# Altium project Controller-RK3562.PrjPcb (part 3 of 8)

## Sheet RK3562-VCCIO2-VCCIO3.SchDoc
size 420 x 297 mm; SheetNumber: 8; SheetTotal: 32
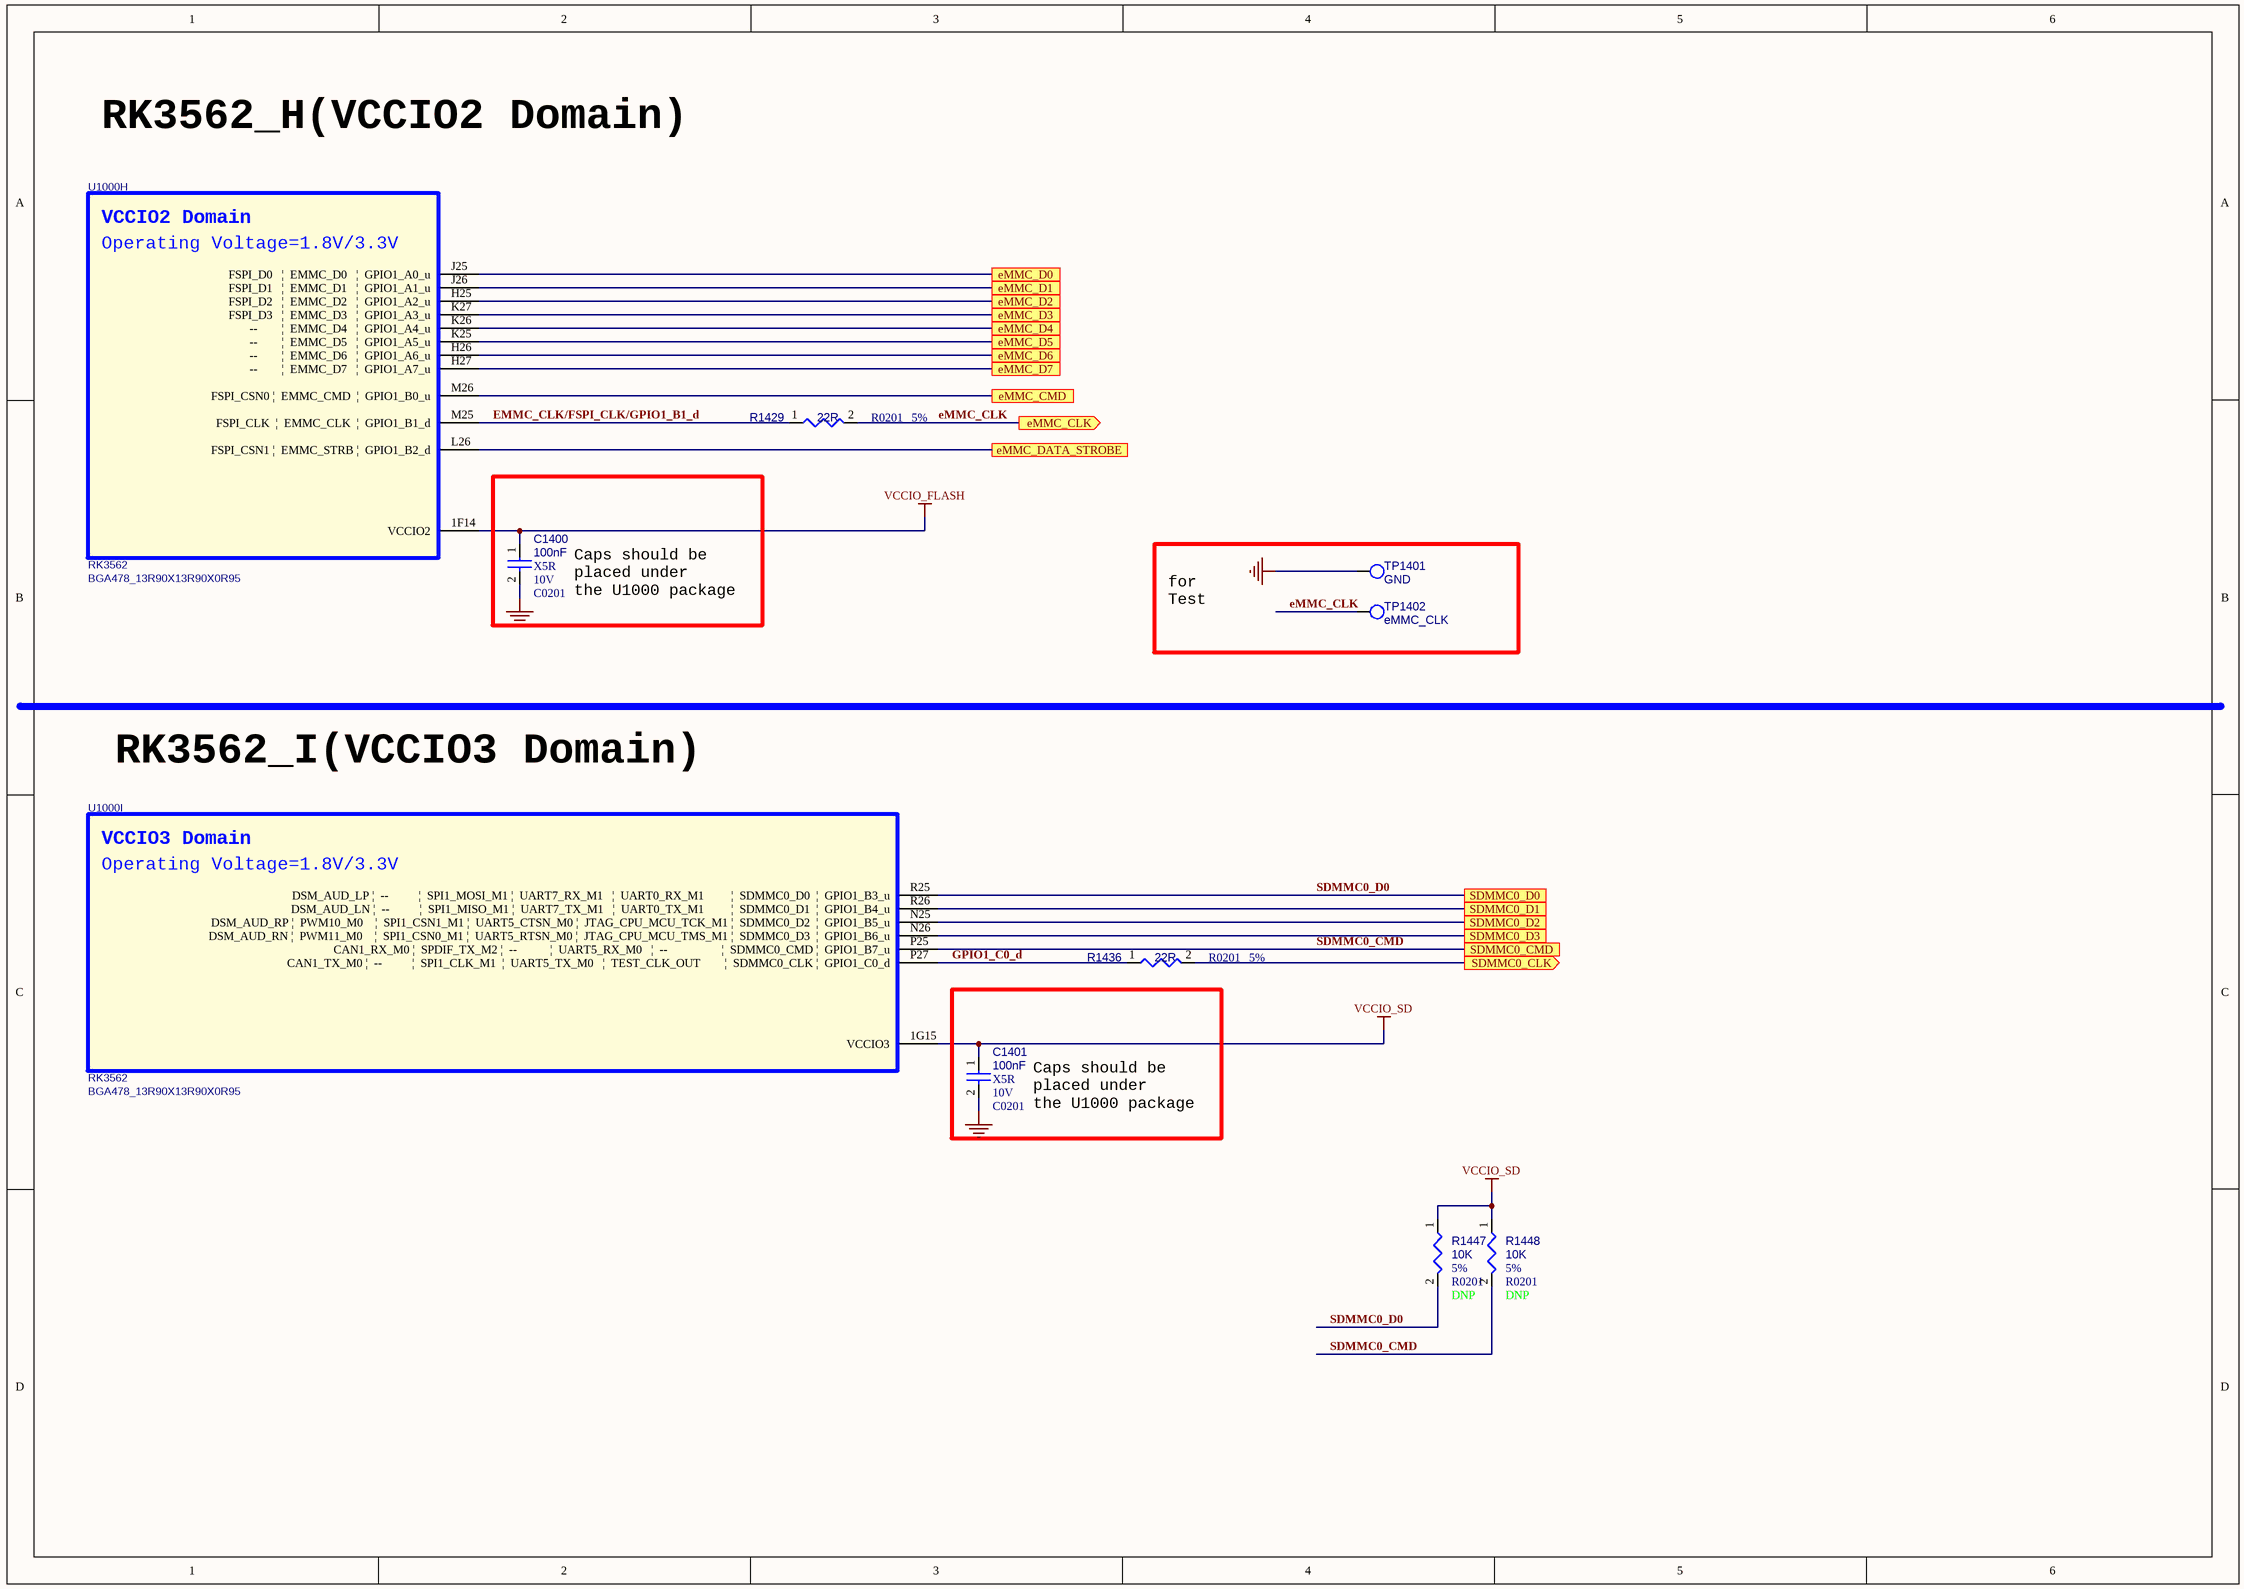
[diagram p9: RK3562-VCCIO2-VCCIO3.SchDoc]

### Parts
C1400  100nF  Dielectric: X5R  Voltage: 10V  [C0201]
C1401  100nF  Dielectric: X5R  Voltage: 10V  [C0201]
R1429  22R  Tolerance: 5%  [R0201]
R1436  22R  Tolerance: 5%  [R0201]
R1447  10K  Tolerance: 5%  option: DNP  [R0201]
R1448  10K  Tolerance: 5%  option: DNP  [R0201]
TP1401  GND  [TP_0R70]
TP1402  eMMC_CLK  [TP_0R70]
U1000  RK3562  [BGA478_13R90X13R90X0R95]  (parts H,I of 16)

### Ports
eMMC_CLK (out, see CONTROLLER-RK3562[4A], eMMC[2A]), eMMC_CMD (see CONTROLLER-RK3562[4A], eMMC[2A]), eMMC_D0 (see CONTROLLER-RK3562[4A], eMMC[2A]), eMMC_D1 (see CONTROLLER-RK3562[4A], eMMC[2A]), eMMC_D2 (see CONTROLLER-RK3562[4A], eMMC[2A]), eMMC_D3 (see CONTROLLER-RK3562[4A], eMMC[2A]), eMMC_D4 (see CONTROLLER-RK3562[4A], eMMC[2A]), eMMC_D5 (see CONTROLLER-RK3562[4A], eMMC[2A]), eMMC_D6 (see CONTROLLER-RK3562[4A], eMMC[2A]), eMMC_D7 (see CONTROLLER-RK3562[4A], eMMC[2A]), eMMC_DATA_STROBE (see CONTROLLER-RK3562[4A], eMMC[1B]), SDMMC0_CLK (out, see CONTROLLER-RK3562[4B], SD_TF-CARD[1A]), SDMMC0_CMD (see CONTROLLER-RK3562[4B], SD_TF-CARD[1A]), SDMMC0_D0 (see CONTROLLER-RK3562[4B], SD_TF-CARD[1A]), SDMMC0_D1 (see CONTROLLER-RK3562[4B], SD_TF-CARD[1A]), SDMMC0_D2 (see CONTROLLER-RK3562[4B], SD_TF-CARD[1A]), SDMMC0_D3 (see CONTROLLER-RK3562[4B], SD_TF-CARD[1A])

### Nets
GND: C1400.2 C1401.2 TP1401.1
VCCIO_FLASH: C1400.1 U1000.1F14(VCCIO2)
VCCIO_SD: C1401.1 R1447.1 R1448.1 U1000.1G15(VCCIO3)
eMMC_CLK: R1429.2 TP1402.1 ; port eMMC_CLK
EMMC_CLK/FSPI_CLK/GPIO1_B1_d: R1429.1 U1000.M25(FSPI_CLK__|__EMMC_CLK__|__GPIO1_B1_d)
eMMC_CMD: U1000.M26(FSPI_CSN0_|__EMMC_CMD__|__GPIO1_B0_u) ; port eMMC_CMD
eMMC_D0: U1000.J25(FSPI_D0___|__EMMC_D0___|__GPIO1_A0_u) ; port eMMC_D0
eMMC_D1: U1000.J26(FSPI_D1___|__EMMC_D1___|__GPIO1_A1_u) ; port eMMC_D1
eMMC_D2: U1000.H25(FSPI_D2___|__EMMC_D2___|__GPIO1_A2_u) ; port eMMC_D2
eMMC_D3: U1000.K27(FSPI_D3___|__EMMC_D3___|__GPIO1_A3_u) ; port eMMC_D3
eMMC_D4: U1000.K26(--________|__EMMC_D4___|__GPIO1_A4_u) ; port eMMC_D4
eMMC_D5: U1000.K25(--________|__EMMC_D5___|__GPIO1_A5_u) ; port eMMC_D5
eMMC_D6: U1000.H26(--________|__EMMC_D6___|__GPIO1_A6_u) ; port eMMC_D6
eMMC_D7: U1000.H27(--________|__EMMC_D7___|__GPIO1_A7_u) ; port eMMC_D7
eMMC_DATA_STROBE: U1000.L26(FSPI_CSN1_|__EMMC_STRB_|__GPIO1_B2_d) ; port eMMC_DATA_STROBE
GPIO1_C0_d: R1436.1 U1000.P27(CAN1_TX_M0_|__--__________|__SPI1_CLK_M1__|__UART5_TX_M0___|__TEST_CLK_OUT________|__SDMMC0_CLK_|__GPIO1_C0_d)
SDMMC0_CLK: R1436.2 ; port SDMMC0_CLK
SDMMC0_CMD: R1448.2 U1000.P25(CAN1_RX_M0_|__SPDIF_TX_M2_|__--___________|__UART5_RX_M0___|__--__________________|__SDMMC0_CMD_|__GPIO1_B7_u) ; port SDMMC0_CMD
SDMMC0_D0: R1447.2 U1000.R25(DSM_AUD_LP_|__--__________|__SPI1_MOSI_M1_|__UART7_RX_M1___|__UART0_RX_M1_________|__SDMMC0_D0__|__GPIO1_B3_u) ; port SDMMC0_D0
SDMMC0_D1: U1000.R26(DSM_AUD_LN_|__--__________|__SPI1_MISO_M1_|__UART7_TX_M1___|__UART0_TX_M1_________|__SDMMC0_D1__|__GPIO1_B4_u) ; port SDMMC0_D1
SDMMC0_D2: U1000.N25(DSM_AUD_RP_|__PWM10_M0____|__SPI1_CSN1_M1_|__UART5_CTSN_M0_|__JTAG_CPU_MCU_TCK_M1_|__SDMMC0_D2__|__GPIO1_B5_u) ; port SDMMC0_D2
SDMMC0_D3: U1000.N26(DSM_AUD_RN_|__PWM11_M0____|__SPI1_CSN0_M1_|__UART5_RTSN_M0_|__JTAG_CPU_MCU_TMS_M1_|__SDMMC0_D3__|__GPIO1_B6_u) ; port SDMMC0_D3

### Notes on the sheet
- RK3562_H(VCCIO2 Domain)
- Caps should be
  placed under
  the U1000 package
- for
  Test
- RK3562_I(VCCIO3 Domain)
- (in symbol SOC_RK3562, part H) VCCIO2 Domain; Operating Voltage=1.8V/3.3V
- (in symbol SOC_RK3562, part I) VCCIO3 Domain; Operating Voltage=1.8V/3.3V

### Library data of the parts
C1400 = CAP NP: cap,100.00nF,+/-10%,10V,X5R,C0201; Part Reference: C1400; Manufacturer PN: C0603X5R1A104K030BC; Manufacturer: TDK; Tolerance: 10%; Priority: A; PCB Footprint: C0201; Value: 100nF; Created by: JJJ; Part Type: C0201; RK PN: C0603X5R1A104K030BC; ClassName: RK
C1401 = CAP NP: cap,100.00nF,+/-10%,10V,X5R,C0201; Part Reference: C1401; Manufacturer: TDK; RK PN: C0603X5R1A104K030BC; Priority: A; Tolerance: 10%; PCB Footprint: C0201; Value: 100nF; Part Type: C0201; Manufacturer PN: C0603X5R1A104K030BC; Created by: JJJ; ClassName: RK
R1429 = RESISTOR: 通用厚膜电阻,22R,+/-5%,R0201,1/20W.; Part Reference: R1429; Manufacturer PN: RC0201JR-0722RL; Manufacturer: YAGEO; Wattage: 1/20W; Priority: A; RK PN: 901000523; PCB Footprint: R0201; Value: 22R; Created by: YTL; Part Type: 通用厚膜电阻; ClassName: RK
R1436 = RESISTOR: 通用厚膜电阻,22R,+/-5%,R0201,1/20W.; Part Reference: R1436; Manufacturer PN: RC0201JR-0722RL; Manufacturer: YAGEO; Wattage: 1/20W; Priority: A; RK PN: 901000523; PCB Footprint: R0201; Value: 22R; Created by: YTL; Part Type: 通用厚膜电阻; ClassName: RK
R1447 = RESISTOR: 通用厚膜电阻,10K,+/-5%,R0201,1/20W.; Part Reference: R1447; Manufacturer PN: RC0201JR-0710KL; Manufacturer: YAGEO; Wattage: 1/20W; Priority: A; RK PN: 901000476; PCB Footprint: R0201; Value: 10K; Created by: YTL; Part Type: 通用厚膜电阻; ClassName: RK
R1448 = RESISTOR: 通用厚膜电阻,10K,+/-5%,R0201,1/20W.; Part Reference: R1448; Manufacturer PN: RC0201JR-0710KL; Manufacturer: YAGEO; Wattage: 1/20W; Priority: A; RK PN: 901000476; PCB Footprint: R0201; Value: 10K; Created by: YTL; Part Type: 通用厚膜电阻; ClassName: RK
TP1401 = TP: Test Point 0.7mm; Part Reference: TP1401; RK PN: TESTPOINT_0R7; Priority: A; PCB Footprint: TP_0R70; Value: GND; Part Type: TP; Created by: JJJ; ClassName: RK
TP1402 = TP: Test Point 0.7mm; Part Reference: TP1402; Priority: A; RK PN: TESTPOINT_0R7; PCB Footprint: TP_0R70; Value: eMMC_CLK; Created by: JJJ; Part Type: TP; ClassName: RK
U1000 = SOC_RK3562: as U1000 on sheet RK3562-POWER-GND; PCB Footprint: BGA478_13R90X13R90X0R95; Value: RK3562; Created by: JJJ; Manufacturer PN: RK3562; Part Type: SOC; ClassName: RK

## Sheet RK3562-VCCIO4.SchDoc
size 420 x 297 mm; SheetNumber: 9; SheetTotal: 32
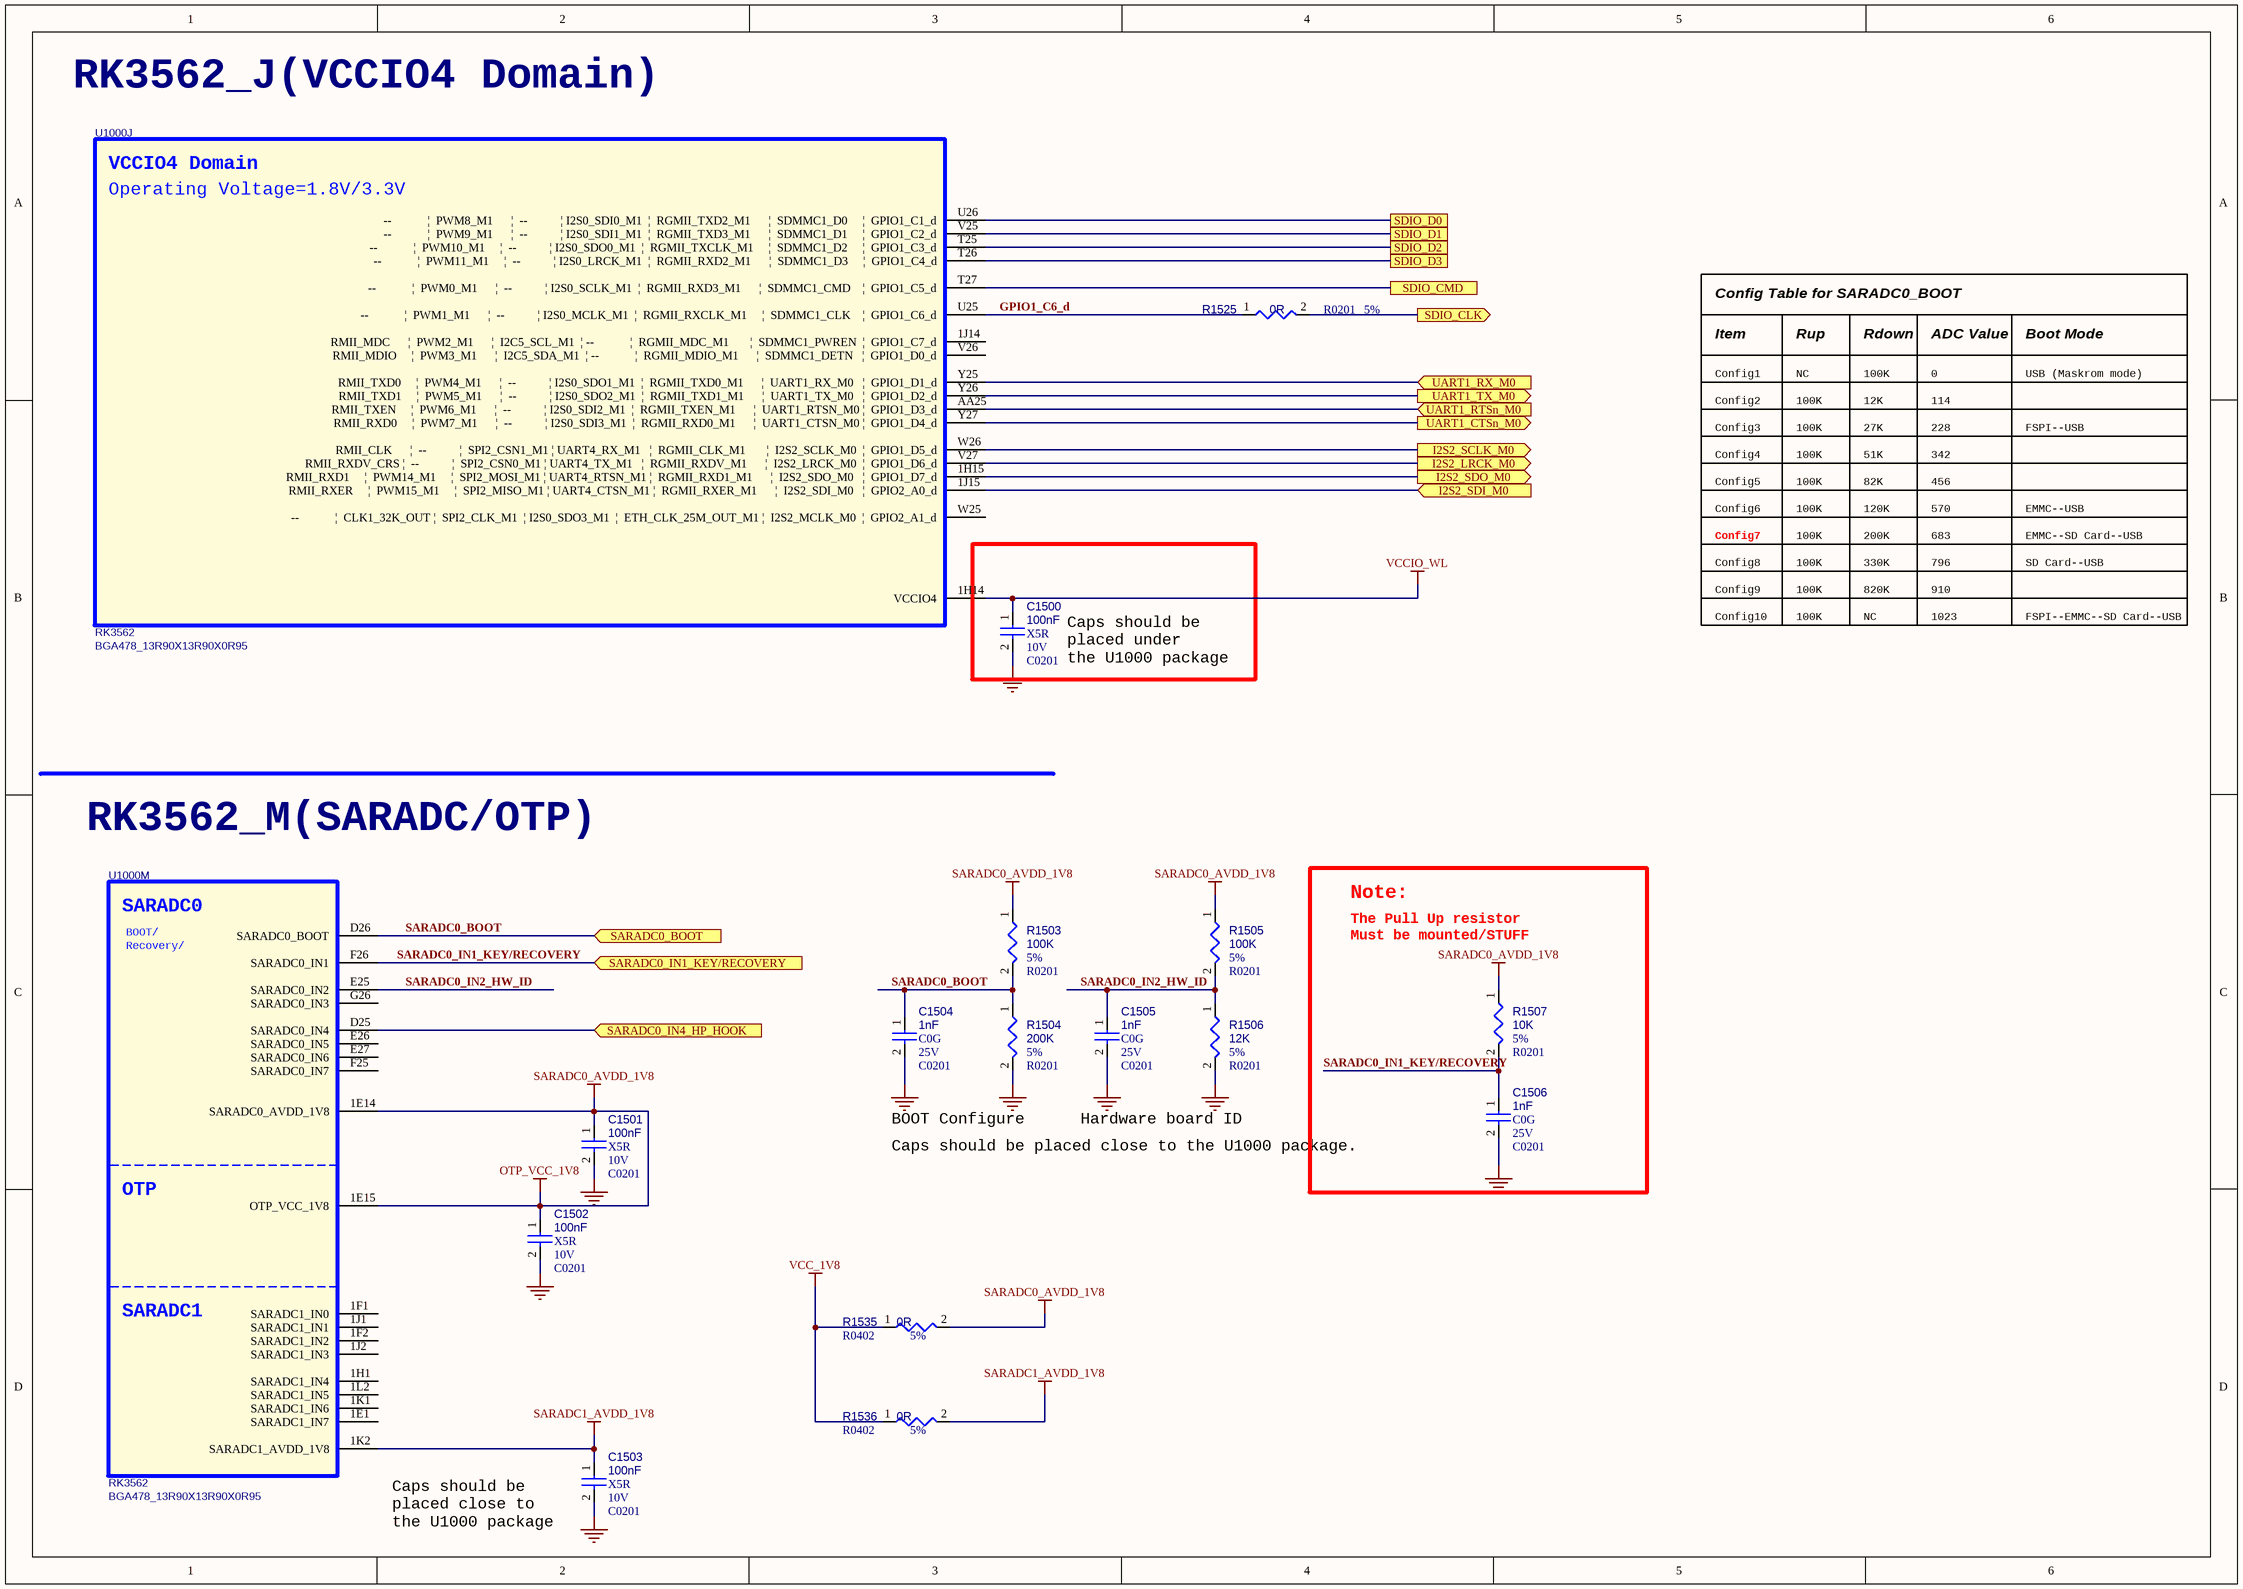
[diagram p10: RK3562-VCCIO4.SchDoc]

### Parts
C1500  100nF  Dielectric: X5R  Voltage: 10V  [C0201]
C1501  100nF  Dielectric: X5R  Voltage: 10V  [C0201]
C1502  100nF  Dielectric: X5R  Voltage: 10V  [C0201]
C1503  100nF  Dielectric: X5R  Voltage: 10V  [C0201]
C1504  1nF  Dielectric: C0G  Voltage: 25V  [C0201]
C1505  1nF  Dielectric: C0G  Voltage: 25V  [C0201]
C1506  1nF  Dielectric: C0G  Voltage: 25V  [C0201]
R1503  100K  Tolerance: 5%  [R0201]
R1504  200K  Tolerance: 5%  [R0201]
R1505  100K  Tolerance: 5%  [R0201]
R1506  12K  Tolerance: 5%  [R0201]
R1507  10K  Tolerance: 5%  [R0201]
R1525  0R  Tolerance: 5%  [R0201]
R1535  0R  Tolerance: 5%  [R0402]
R1536  0R  Tolerance: 5%  [R0402]
U1000  RK3562  [BGA478_13R90X13R90X0R95]  (parts J,M of 16)

### Blocks framed on the sheet
Note:: C1506 R1507

### Ports
I2S2_LRCK_M0 (out, see CONTROLLER-RK3562[4B], CONTROLLER-RK3562[3B], WF-BT-AP6256[1A]), I2S2_SCLK_M0 (out, see CONTROLLER-RK3562[4B], CONTROLLER-RK3562[3B], WF-BT-AP6256[1A]), I2S2_SDI_M0 (in, see CONTROLLER-RK3562[4B], CONTROLLER-RK3562[3B], WF-BT-AP6256[1B]), I2S2_SDO_M0 (out, see CONTROLLER-RK3562[4B], CONTROLLER-RK3562[3B], WF-BT-AP6256[1B]), SARADC0_BOOT (in, see CONTROLLER-RK3562[4B]), SARADC0_IN1_KEY/RECOVERY (in, see CONTROLLER-RK3562[4B]), SARADC0_IN4_HP_HOOK (in, see CONTROLLER-RK3562[4B]), SDIO_CLK (out, see CONTROLLER-RK3562[4B], CONTROLLER-RK3562[3B], WF-BT-AP6256[1A]), SDIO_CMD (see CONTROLLER-RK3562[4B], CONTROLLER-RK3562[3B], WF-BT-AP6256[1A]), SDIO_D0 (see CONTROLLER-RK3562[4B], CONTROLLER-RK3562[3B], WF-BT-AP6256[1A]), SDIO_D1 (see CONTROLLER-RK3562[4B], CONTROLLER-RK3562[3B], WF-BT-AP6256[1A]), SDIO_D2 (see CONTROLLER-RK3562[4B], CONTROLLER-RK3562[3B], WF-BT-AP6256[1A]), SDIO_D3 (see CONTROLLER-RK3562[4B], CONTROLLER-RK3562[3B], WF-BT-AP6256[1A]), UART1_CTSn_M0 (out, see CONTROLLER-RK3562[4B], CONTROLLER-RK3562[3B], WF-BT-AP6256[1A]), UART1_RTSn_M0 (in, see CONTROLLER-RK3562[4B], CONTROLLER-RK3562[3B], WF-BT-AP6256[1A]), UART1_RX_M0 (in, see CONTROLLER-RK3562[4B]), UART1_TX_M0 (out, see CONTROLLER-RK3562[4B])

### Nets
GND: C1500.2 C1501.2 C1502.2 C1503.2 C1504.2 C1505.2 C1506.2 R1504.2 R1506.2
OTP_VCC_1V8: C1501.1 C1502.1 R1503.1 R1505.1 R1507.1 R1535.2 U1000.1E14(SARADC0_AVDD_1V8) U1000.1E15(OTP_VCC_1V8)  [also labelled SARADC0_AVDD_1V8]
SARADC1_AVDD_1V8: C1503.1 R1536.2 U1000.1K2(SARADC1_AVDD_1V8)
VCC_1V8: R1535.1 R1536.1
VCCIO_WL: C1500.1 U1000.1H14(VCCIO4)
GPIO1_C6_d: R1525.1 U1000.U25(--____________|__PWM1_M1______|__--___________|_I2S0_MCLK_M1__|__RGMII_RXCLK_M1_____|__SDMMC1_CLK____|__GPIO1_C6_d)
I2S2_LRCK_M0: U1000.V27(RMII_RXDV_CRS_|__--___________|__SPI2_CSN0_M1_|_UART4_TX_M1___|__RGMII_RXDV_M1______|__I2S2_LRCK_M0__|__GPIO1_D6_d) ; port I2S2_LRCK_M0
I2S2_SCLK_M0: U1000.W26(RMII_CLK______|__--___________|__SPI2_CSN1_M1_|_UART4_RX_M1___|__RGMII_CLK_M1_______|__I2S2_SCLK_M0__|__GPIO1_D5_d) ; port I2S2_SCLK_M0
I2S2_SDI_M0: U1000.1J15(RMII_RXER_____|__PWM15_M1_____|__SPI2_MISO_M1_|_UART4_CTSN_M1_|__RGMII_RXER_M1______|__I2S2_SDI_M0___|__GPIO2_A0_d) ; port I2S2_SDI_M0
I2S2_SDO_M0: U1000.1H15(RMII_RXD1_____|__PWM14_M1_____|__SPI2_MOSI_M1_|_UART4_RTSN_M1_|__RGMII_RXD1_M1______|__I2S2_SDO_M0___|__GPIO1_D7_d) ; port I2S2_SDO_M0
SARADC0_BOOT: C1504.1 R1503.2 R1504.1 U1000.D26(SARADC0_BOOT) ; port SARADC0_BOOT
SARADC0_IN1_KEY/RECOVERY: C1506.1 R1507.2 U1000.F26(SARADC0_IN1) ; port SARADC0_IN1_KEY/RECOVERY
SARADC0_IN2_HW_ID: C1505.1 R1505.2 R1506.1 U1000.E25(SARADC0_IN2)
SDIO_CLK: R1525.2 ; port SDIO_CLK
SDIO_CMD: U1000.T27(--____________|__PWM0_M1______|__--___________|_I2S0_SCLK_M1__|__RGMII_RXD3_M1______|__SDMMC1_CMD____|__GPIO1_C5_d) ; port SDIO_CMD
SDIO_D0: U1000.U26(--____________|__PWM8_M1______|__--___________|_I2S0_SDI0_M1__|__RGMII_TXD2_M1______|__SDMMC1_D0_____|__GPIO1_C1_d) ; port SDIO_D0
SDIO_D1: U1000.V25(--____________|__PWM9_M1______|__--___________|_I2S0_SDI1_M1__|__RGMII_TXD3_M1______|__SDMMC1_D1_____|__GPIO1_C2_d) ; port SDIO_D1
SDIO_D2: U1000.T25(--____________|__PWM10_M1_____|__--___________|_I2S0_SDO0_M1__|__RGMII_TXCLK_M1_____|__SDMMC1_D2_____|__GPIO1_C3_d) ; port SDIO_D2
SDIO_D3: U1000.T26(--____________|__PWM11_M1_____|__--___________|_I2S0_LRCK_M1__|__RGMII_RXD2_M1______|__SDMMC1_D3_____|__GPIO1_C4_d) ; port SDIO_D3
UART1_CTSn_M0: U1000.Y27(RMII_RXD0_____|__PWM7_M1______|__--___________|_I2S0_SDI3_M1__|__RGMII_RXD0_M1______|__UART1_CTSN_M0_|__GPIO1_D4_d) ; port UART1_CTSn_M0
UART1_RTSn_M0: U1000.AA25(RMII_TXEN_____|__PWM6_M1______|__--___________|_I2S0_SDI2_M1__|__RGMII_TXEN_M1______|__UART1_RTSN_M0_|__GPIO1_D3_d) ; port UART1_RTSn_M0
UART1_RX_M0: U1000.Y26(RMII_TXD1_____|__PWM5_M1______|__--___________|_I2S0_SDO2_M1__|__RGMII_TXD1_M1______|__UART1_TX_M0___|__GPIO1_D2_d) ; port UART1_TX_M0
UART1_TX_M0: U1000.Y25(RMII_TXD0_____|__PWM4_M1______|__--___________|_I2S0_SDO1_M1__|__RGMII_TXD0_M1______|__UART1_RX_M0___|__GPIO1_D1_d) ; port UART1_RX_M0
NetU1000_D25: U1000.D25(SARADC0_IN4) ; port SARADC0_IN4_HP_HOOK

Not connected (* = marked no-connect by the designer): U1000 1E1(SARADC1_IN7) 1F1(SARADC1_IN0) 1F2(SARADC1_IN2) 1H1(SARADC1_IN4) 1J1(SARADC1_IN1) 1J2(SARADC1_IN3) 1J14(RMII_MDC______|__PWM2_M1______|__I2C5_SCL_M1__|_--____________|__RGMII_MDC_M1_______|__SDMMC1_PWREN__|__GPIO1_C7_d) 1K1(SARADC1_IN6) 1L2(SARADC1_IN5) E26(SARADC0_IN5) E27(SARADC0_IN6) F25(SARADC0_IN7) G26(SARADC0_IN3) V26(RMII_MDIO_____|__PWM3_M1______|__I2C5_SDA_M1__|_--____________|__RGMII_MDIO_M1______|__SDMMC1_DETN___|__GPIO1_D0_d) W25(--____________|__CLK1_32K_OUT_|__SPI2_CLK_M1__|_I2S0_SDO3_M1__|__ETH_CLK_25M_OUT_M1_|__I2S2_MCLK_M0__|__GPIO2_A1_d)

### Notes on the sheet
- RK3562_J(VCCIO4 Domain)
- Config Table for SARADC0_BOOT
- Item
- Config1
- Rup
- NC
- Rdown
- 100K
- ADC Value
- 0
- Boot Mode
- USB (Maskrom mode)
- Config2
- Config3
- Config4
- 12K
- 27K
- 51K
- 114
- 228
- 342
- FSPI--USB
- Config5
- Config6
- 82K
- 120K
- 456
- 570
- EMMC--USB
- Config7
- Config8
- Config9
- 200K
- 330K
- 820K
- 683
- 796
- 910
- EMMC--SD Card--USB
- SD Card--USB
- Caps should be
  placed under
  the U1000 package
- Config10
- 1023
- FSPI--EMMC--SD Card--USB
- RK3562_M(SARADC/OTP)
- The Pull Up resistor
  Must be mounted/STUFF
- BOOT Configure
- Hardware board ID
- Caps should be placed close to the U1000 package.
- (near C1503) Caps should be
  placed close to
  the U1000 package
- (in symbol SOC_RK3562, part J) VCCIO4 Domain; Operating Voltage=1.8V/3.3V
- (in symbol SOC_RK3562, part M) SARADC0; BOOT/; Recovery/; OTP; SARADC1

### Library data of the parts
C1500 = CAP NP: cap,100.00nF,+/-10%,10V,X5R,C0201; Part Reference: C1500; Manufacturer: TDK; RK PN: C0603X5R1A104K030BC; Priority: A; Tolerance: 10%; PCB Footprint: C0201; Value: 100nF; Part Type: C0201; Manufacturer PN: C0603X5R1A104K030BC; Created by: JJJ; ClassName: RK
C1501 = CAP NP: cap,100.00nF,+/-10%,10V,X5R,C0201; Part Reference: C1501; Manufacturer: TDK; RK PN: C0603X5R1A104K030BC; Priority: A; Tolerance: 10%; PCB Footprint: C0201; Value: 100nF; Part Type: C0201; Manufacturer PN: C0603X5R1A104K030BC; Created by: JJJ; ClassName: RK
C1502 = CAP NP: cap,100.00nF,+/-10%,10V,X5R,C0201; Part Reference: C1502; Manufacturer PN: C0603X5R1A104K030BC; Manufacturer: TDK; Tolerance: 10%; Priority: A; PCB Footprint: C0201; Value: 100nF; Created by: JJJ; Part Type: C0201; RK PN: C0603X5R1A104K030BC; ClassName: RK
C1503 = CAP NP: cap,100.00nF,+/-10%,10V,X5R,C0201; Part Reference: C1503; Manufacturer: TDK; RK PN: C0603X5R1A104K030BC; Priority: A; Tolerance: 10%; PCB Footprint: C0201; Value: 100nF; Part Type: C0201; Manufacturer PN: C0603X5R1A104K030BC; Created by: JJJ; ClassName: RK
C1504 = CAP NP: 一般用片状陶瓷电容(GRM),cap,1nF,±5%,25V,C0G,C0201; Part Reference: C1504; Manufacturer PN: GRM0335C1E102JA01; Manufacturer: murata; Priority: A; RK PN: 902004752; PCB Footprint: C0201; Value: 1nF; Created by: JJJ; Tolerance: ±5%; Part Type: 一般用片状陶瓷电容; ClassName: RK
C1505 = CAP NP: 一般用片状陶瓷电容(GRM),cap,1nF,±5%,25V,C0G,C0201; Part Reference: C1505; Manufacturer: murata; Manufacturer PN: GRM0335C1E102JA01; RK PN: 902004752; Priority: A; PCB Footprint: C0201; Value: 1nF; Part Type: 一般用片状陶瓷电容; Tolerance: ±5%; Created by: JJJ; ClassName: RK
C1506 = CAP NP: 一般用片状陶瓷电容(GRM),cap,1nF,±5%,25V,C0G,C0201; Part Reference: C1506; Manufacturer: murata; Manufacturer PN: GRM0335C1E102JA01; RK PN: 902004752; Priority: A; PCB Footprint: C0201; Value: 1nF; Part Type: 一般用片状陶瓷电容; Tolerance: ±5%; Created by: JJJ; ClassName: RK
R1503 = RESISTOR: 通用厚膜电阻,100K,+/-5%,R0201,1/20W.; Part Reference: R1503; Manufacturer: YAGEO; Manufacturer PN: RC0201JR-07100KL; RK PN: 901000474; Priority: A; Wattage: 1/20W; PCB Footprint: R0201; Value: 100K; Part Type: 通用厚膜电阻; Created by: YTL; ClassName: RK
R1504 = RESISTOR: 通用厚膜电阻,200K,+/-5%,R0201,1/20W.; Part Reference: R1504; Manufacturer: YAGEO; Manufacturer PN: RC0201JR-07200KL; RK PN: 901000516; Priority: A; Wattage: 1/20W; PCB Footprint: R0201; Value: 200K; Part Type: 通用厚膜电阻; Created by: YTL; ClassName: RK
R1505 = RESISTOR: 通用厚膜电阻,100K,+/-5%,R0201,1/20W.; Part Reference: R1505; Manufacturer PN: RC0201JR-07100KL; Manufacturer: YAGEO; Wattage: 1/20W; Priority: A; RK PN: 901000474; PCB Footprint: R0201; Value: 100K; Created by: YTL; Part Type: 通用厚膜电阻; ClassName: RK
R1506 = RESISTOR: 通用厚膜电阻,12K,+/-5%,R0201,1/20W.; Part Reference: R1506; Manufacturer: YAGEO; Manufacturer PN: RC0201JR-0712KL; RK PN: 901000485; Priority: A; Wattage: 1/20W; PCB Footprint: R0201; Value: 12K; Part Type: 通用厚膜电阻; Created by: YTL; ClassName: RK
R1507 = RESISTOR: 通用厚膜电阻,10K,+/-5%,R0201,1/20W.; Part Reference: R1507; Manufacturer PN: RC0201JR-0710KL; Manufacturer: YAGEO; Wattage: 1/20W; Priority: A; RK PN: 901000476; PCB Footprint: R0201; Value: 10K; Created by: YTL; Part Type: 通用厚膜电阻; ClassName: RK
R1525 = RESISTOR: 通用厚膜电阻,0R,+/-5%,R0201,1/20W.; Part Reference: R1525; Manufacturer: YAGEO; Manufacturer PN: RC0201JR-070RL; RK PN: 901000473; Priority: A; Wattage: 1/20W; PCB Footprint: R0201; Value: 0R; Part Type: 通用厚膜电阻; Created by: YTL; ClassName: RK
R1535 R1536 = RESISTOR: 通用厚膜电阻,0R,+/-5%,R0402,1/16W.; Part Reference: R1604; Manufacturer PN: RC0402JR-070RL; Manufacturer: YAGEO; Wattage: 1/16W; Priority: A; RK PN: 901001446; PCB Footprint: R0402; Value: 0R; Created by: YTL; Part Type: 通用厚膜电阻; ClassName: RK
U1000 = SOC_RK3562: ROCKCHIP SOC; Part Reference: U1000; Manufacturer: Rockchip (瑞芯微); SPLIT_INST: TRUE; SWAP_INFO: (S1+S2+S3+S4+S5+S6+S7+S8+S9+S10+S11+S12+S13+S14+S15+S16); RK PN: 906000425; Priority: A; PCB Footprint: BGA478_13R90X13R90X0R95; Value: RK3562; Part Type: SOC; Manufacturer PN: RK3562; Created by: JJJ; ClassName: RK

## Sheet RK3562-VCCIO5.SchDoc
size 420 x 297 mm; SheetNumber: 10; SheetTotal: 32
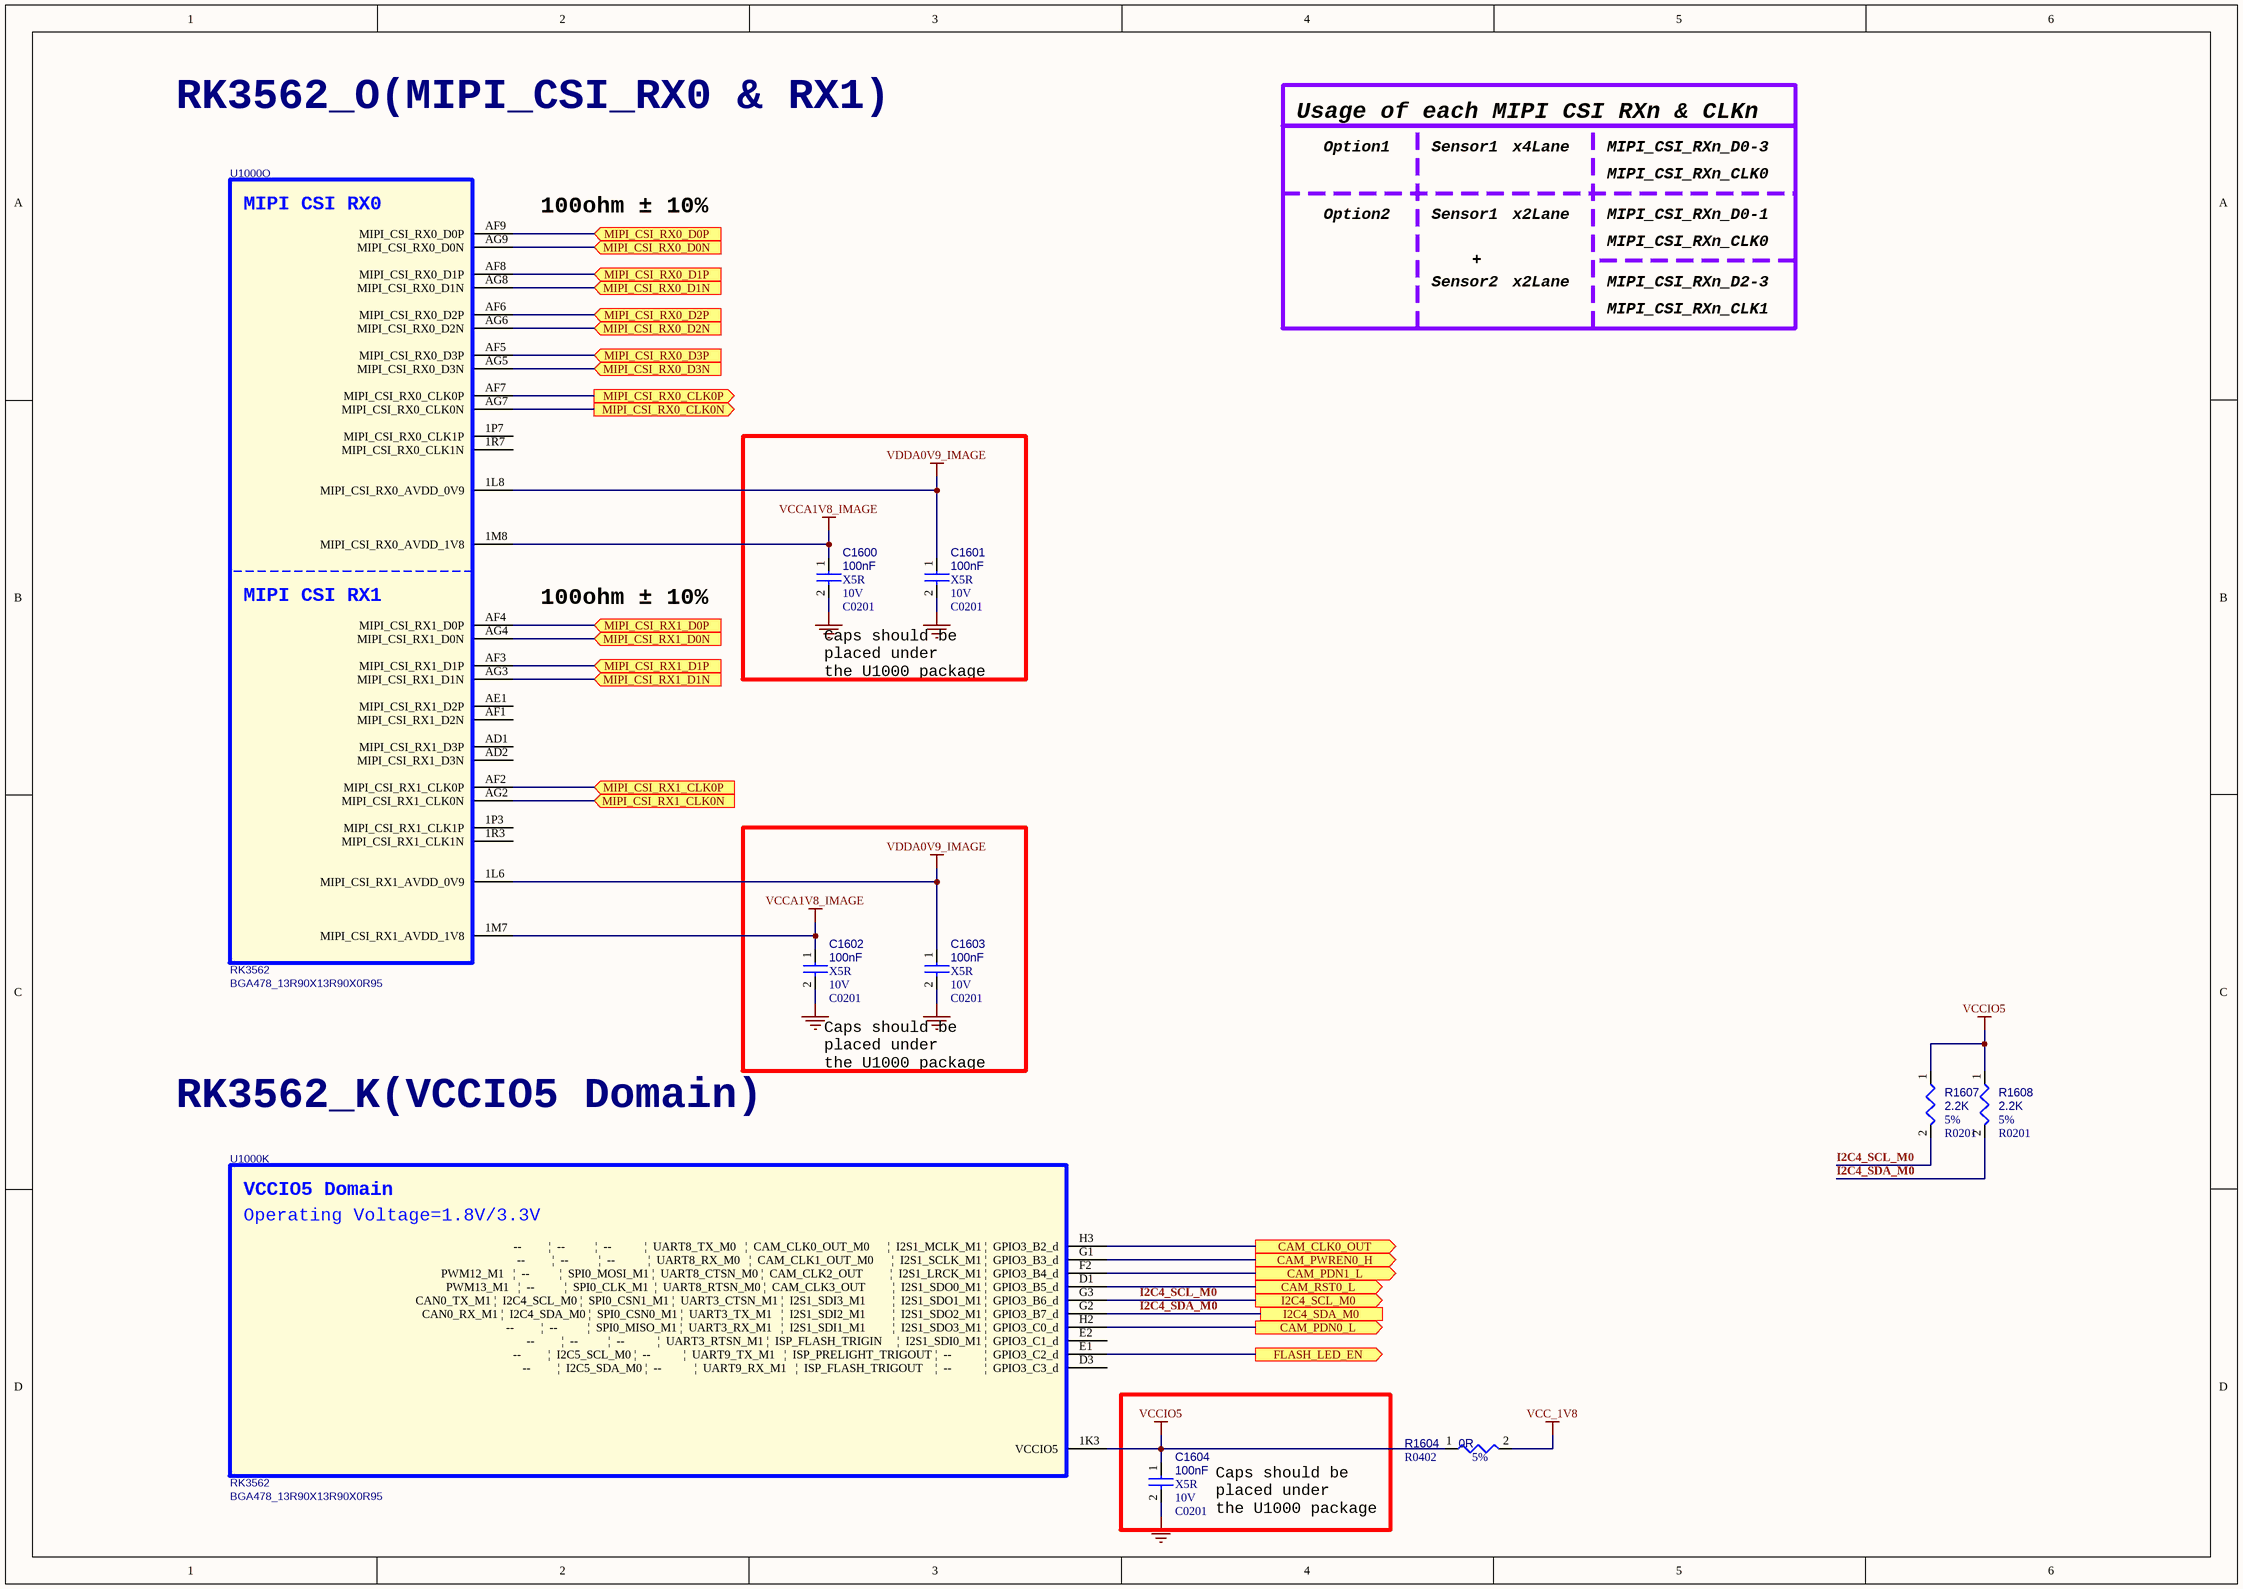
[diagram p11: RK3562-VCCIO5.SchDoc]

### Parts
C1600  100nF  Dielectric: X5R  Voltage: 10V  [C0201]
C1601  100nF  Dielectric: X5R  Voltage: 10V  [C0201]
C1602  100nF  Dielectric: X5R  Voltage: 10V  [C0201]
C1603  100nF  Dielectric: X5R  Voltage: 10V  [C0201]
C1604  100nF  Dielectric: X5R  Voltage: 10V  [C0201]
R1604  0R  Tolerance: 5%  [R0402]
R1607  2.2K  Tolerance: 5%  [R0201]
R1608  2.2K  Tolerance: 5%  [R0201]
U1000  RK3562  [BGA478_13R90X13R90X0R95]  (parts K,O of 16)

### Ports
CAM_CLK0_OUT (out, see CONTROLLER-RK3562[4C], CONTROLLER-RK3562[3C], MIPI-CAMERA[1B]), CAM_PDN0_L (out, see CONTROLLER-RK3562[4C], CONTROLLER-RK3562[3C], MIPI-CAMERA[1C]), CAM_PDN1_L (out, see CONTROLLER-RK3562[4C]), CAM_PWREN0_H (out, see CONTROLLER-RK3562[4C]), CAM_RST0_L (out, see CONTROLLER-RK3562[4C], CONTROLLER-RK3562[3C], MIPI-CAMERA[1B]), FLASH_LED_EN (out, see CONTROLLER-RK3562[4C]), I2C4_SCL_M0 (out, see CONTROLLER-RK3562[4C], CONTROLLER-RK3562[3C], MIPI-CAMERA[1B]), I2C4_SDA_M0 (see CONTROLLER-RK3562[4C], CONTROLLER-RK3562[3C], MIPI-CAMERA[1B]), MIPI_CSI_RX0_CLK0N (out, see CONTROLLER-RK3562[4C], CONTROLLER-RK3562[3C], MIPI-CAMERA[1B]), MIPI_CSI_RX0_CLK0P (out, see CONTROLLER-RK3562[4C], CONTROLLER-RK3562[3C], MIPI-CAMERA[1B]), MIPI_CSI_RX0_D0N (in, see CONTROLLER-RK3562[4B], CONTROLLER-RK3562[3B], MIPI-CAMERA[1B]), MIPI_CSI_RX0_D0P (in, see CONTROLLER-RK3562[4B], CONTROLLER-RK3562[3B], MIPI-CAMERA[1B]), MIPI_CSI_RX0_D1N (in, see CONTROLLER-RK3562[4C], CONTROLLER-RK3562[3C], MIPI-CAMERA[1B]), MIPI_CSI_RX0_D1P (in, see CONTROLLER-RK3562[4B], CONTROLLER-RK3562[3B], MIPI-CAMERA[1B]), MIPI_CSI_RX0_D2N (in, see CONTROLLER-RK3562[4C], CONTROLLER-RK3562[3C], MIPI-CAMERA[1B]), MIPI_CSI_RX0_D2P (in, see CONTROLLER-RK3562[4C], CONTROLLER-RK3562[3C], MIPI-CAMERA[1B]), MIPI_CSI_RX0_D3N (in, see CONTROLLER-RK3562[4C], CONTROLLER-RK3562[3C], MIPI-CAMERA[1B]), MIPI_CSI_RX0_D3P (in, see CONTROLLER-RK3562[4C], CONTROLLER-RK3562[3C], MIPI-CAMERA[1B]), MIPI_CSI_RX1_CLK0N (in, see CONTROLLER-RK3562[4C]), MIPI_CSI_RX1_CLK0P (in, see CONTROLLER-RK3562[4C]), MIPI_CSI_RX1_D0N (in, see CONTROLLER-RK3562[4C]), MIPI_CSI_RX1_D0P (in, see CONTROLLER-RK3562[4C]), MIPI_CSI_RX1_D1N (in, see CONTROLLER-RK3562[4C]), MIPI_CSI_RX1_D1P (in, see CONTROLLER-RK3562[4C])

### Nets
GND: C1600.2 C1601.2 C1602.2 C1603.2 C1604.2
VCC_1V8: R1604.2
VCCA1V8_IMAGE: C1600.1 C1602.1 U1000.1M7(MIPI_CSI_RX1_AVDD_1V8) U1000.1M8(MIPI_CSI_RX0_AVDD_1V8)
VCCIO5: C1604.1 R1604.1 R1607.1 R1608.1 U1000.1K3(VCCIO5)
VDDA0V9_IMAGE: C1601.1 C1603.1 U1000.1L6(MIPI_CSI_RX1_AVDD_0V9) U1000.1L8(MIPI_CSI_RX0_AVDD_0V9)
CAM_CLK0_OUT: U1000.H3(--_________|__--__________|__--___________|__UART8_TX_M0___|__CAM_CLK0_OUT_M0______|__I2S1_MCLK_M1_|__GPIO3_B2_d) ; port CAM_CLK0_OUT
CAM_PDN0_L: U1000.H2(--_________|__--__________|__SPI0_MISO_M1_|__UART3_RX_M1___|__I2S1_SDI1_M1_________|__I2S1_SDO3_M1_|__GPIO3_C0_d) ; port CAM_PDN0_L
CAM_PWREN_H: U1000.G1(--_________|__--__________|__--___________|__UART8_RX_M0___|__CAM_CLK1_OUT_M0______|__I2S1_SCLK_M1_|__GPIO3_B3_d) ; port CAM_PWREN0_H
CAM_RST0_L: U1000.D1(PWM13_M1___|__--__________|__SPI0_CLK_M1__|__UART8_RTSN_M0_|__CAM_CLK3_OUT_________|__I2S1_SDO0_M1_|__GPIO3_B5_d) ; port CAM_RST0_L
I2C4_SCL_M0: R1607.2 U1000.G3(CAN0_TX_M1_|__I2C4_SCL_M0_|__SPI0_CSN1_M1_|__UART3_CTSN_M1_|__I2S1_SDI3_M1_________|__I2S1_SDO1_M1_|__GPIO3_B6_d) ; port I2C4_SCL_M0
I2C4_SDA_M0: R1608.2 U1000.G2(CAN0_RX_M1_|__I2C4_SDA_M0_|__SPI0_CSN0_M1_|__UART3_TX_M1___|__I2S1_SDI2_M1_________|__I2S1_SDO2_M1_|__GPIO3_B7_d) ; port I2C4_SDA_M0
MIPI_CSI_RX0_CLK0_N: U1000.AG7(MIPI_CSI_RX0_CLK0N) ; port MIPI_CSI_RX0_CLK0N
MIPI_CSI_RX0_CLK0_P: U1000.AF7(MIPI_CSI_RX0_CLK0P) ; port MIPI_CSI_RX0_CLK0P
MIPI_CSI_RX0_D0_N: U1000.AG9(MIPI_CSI_RX0_D0N) ; port MIPI_CSI_RX0_D0N
MIPI_CSI_RX0_D0_P: U1000.AF9(MIPI_CSI_RX0_D0P) ; port MIPI_CSI_RX0_D0P
MIPI_CSI_RX0_D1_N: U1000.AG8(MIPI_CSI_RX0_D1N) ; port MIPI_CSI_RX0_D1N
MIPI_CSI_RX0_D1_P: U1000.AF8(MIPI_CSI_RX0_D1P) ; port MIPI_CSI_RX0_D1P
MIPI_CSI_RX0_D2_N: U1000.AG6(MIPI_CSI_RX0_D2N) ; port MIPI_CSI_RX0_D2N
MIPI_CSI_RX0_D2_P: U1000.AF6(MIPI_CSI_RX0_D2P) ; port MIPI_CSI_RX0_D2P
MIPI_CSI_RX0_D3_N: U1000.AG5(MIPI_CSI_RX0_D3N) ; port MIPI_CSI_RX0_D3N
MIPI_CSI_RX0_D3_P: U1000.AF5(MIPI_CSI_RX0_D3P) ; port MIPI_CSI_RX0_D3P
NetU1000_AF2: U1000.AF2(MIPI_CSI_RX1_CLK0P) ; port MIPI_CSI_RX1_CLK0P
NetU1000_AF3: U1000.AF3(MIPI_CSI_RX1_D1P) ; port MIPI_CSI_RX1_D1P
NetU1000_AF4: U1000.AF4(MIPI_CSI_RX1_D0P) ; port MIPI_CSI_RX1_D0P
NetU1000_AG2: U1000.AG2(MIPI_CSI_RX1_CLK0N) ; port MIPI_CSI_RX1_CLK0N
NetU1000_AG3: U1000.AG3(MIPI_CSI_RX1_D1N) ; port MIPI_CSI_RX1_D1N
NetU1000_AG4: U1000.AG4(MIPI_CSI_RX1_D0N) ; port MIPI_CSI_RX1_D0N
NetU1000_E1: U1000.E1(--_________|__I2C5_SCL_M0_|__--___________|__UART9_TX_M1___|__ISP_PRELIGHT_TRIGOUT_|__--___________|__GPIO3_C2_d) ; port FLASH_LED_EN
NetU1000_F2: U1000.F2(PWM12_M1___|__--__________|__SPI0_MOSI_M1_|__UART8_CTSN_M0_|__CAM_CLK2_OUT_________|__I2S1_LRCK_M1_|__GPIO3_B4_d) ; port CAM_PDN1_L

Not connected (* = marked no-connect by the designer): U1000 1P3(MIPI_CSI_RX1_CLK1P) 1P7(MIPI_CSI_RX0_CLK1P) 1R3(MIPI_CSI_RX1_CLK1N) 1R7(MIPI_CSI_RX0_CLK1N) AD1(MIPI_CSI_RX1_D3P) AD2(MIPI_CSI_RX1_D3N) AE1(MIPI_CSI_RX1_D2P) AF1(MIPI_CSI_RX1_D2N) D3(--_________|__I2C5_SDA_M0_|__--___________|__UART9_RX_M1___|__ISP_FLASH_TRIGOUT____|__--___________|__GPIO3_C3_d) E2(--_________|__--__________|__--___________|__UART3_RTSN_M1_|__ISP_FLASH_TRIGIN_____|__I2S1_SDI0_M1_|__GPIO3_C1_d)

### Notes on the sheet
- RK3562_O(MIPI_CSI_RX0 & RX1)
- Usage of each MIPI CSI RXn & CLKn
- Option1
- Sensor1
- x4Lane
- MIPI_CSI_RXn_D0-3
- MIPI_CSI_RXn_CLK0
- 100ohm ± 10%
- Option2
- x2Lane
- MIPI_CSI_RXn_D0-1
- Sensor2
- +
- MIPI_CSI_RXn_D2-3
- MIPI_CSI_RXn_CLK1
- Caps should be
  placed under
  the U1000 package
- RK3562_K(VCCIO5 Domain)
- (in symbol SOC_RK3562, part K) VCCIO5 Domain; Operating Voltage=1.8V/3.3V
- (in symbol SOC_RK3562, part O) MIPI CSI RX0; MIPI CSI RX1

### Library data of the parts
C1600 = CAP NP: cap,100.00nF,+/-10%,10V,X5R,C0201; Part Reference: C1600; Manufacturer: TDK; RK PN: C0603X5R1A104K030BC; Priority: A; Tolerance: 10%; PCB Footprint: C0201; Value: 100nF; Part Type: C0201; Manufacturer PN: C0603X5R1A104K030BC; Created by: JJJ; ClassName: RK
C1601 = CAP NP: cap,100.00nF,+/-10%,10V,X5R,C0201; Part Reference: C1601; Manufacturer PN: C0603X5R1A104K030BC; Manufacturer: TDK; Tolerance: 10%; Priority: A; PCB Footprint: C0201; Value: 100nF; Created by: JJJ; Part Type: C0201; RK PN: C0603X5R1A104K030BC; ClassName: RK
C1602 = CAP NP: cap,100.00nF,+/-10%,10V,X5R,C0201; Part Reference: C1602; Manufacturer: TDK; RK PN: C0603X5R1A104K030BC; Priority: A; Tolerance: 10%; PCB Footprint: C0201; Value: 100nF; Part Type: C0201; Manufacturer PN: C0603X5R1A104K030BC; Created by: JJJ; ClassName: RK
C1603 = CAP NP: cap,100.00nF,+/-10%,10V,X5R,C0201; Part Reference: C1603; Manufacturer PN: C0603X5R1A104K030BC; Manufacturer: TDK; Tolerance: 10%; Priority: A; PCB Footprint: C0201; Value: 100nF; Created by: JJJ; Part Type: C0201; RK PN: C0603X5R1A104K030BC; ClassName: RK
C1604 = CAP NP: cap,100.00nF,+/-10%,10V,X5R,C0201; Part Reference: C1604; Manufacturer: TDK; RK PN: C0603X5R1A104K030BC; Priority: A; Tolerance: 10%; PCB Footprint: C0201; Value: 100nF; Part Type: C0201; Manufacturer PN: C0603X5R1A104K030BC; Created by: JJJ; ClassName: RK
R1604 = RESISTOR: as R1535 on sheet RK3562-VCCIO4; PCB Footprint: R0402; Value: 0R; Created by: YTL; Part Type: 通用厚膜电阻; ClassName: RK
R1607 = RESISTOR: 通用厚膜电阻,2K2,+/-5%,R0201,1/20W.; Part Reference: R1607; Manufacturer: YAGEO; Manufacturer PN: RC0201JR-072K2L; RK PN: 901000532; Priority: A; Wattage: 1/20W; PCB Footprint: R0201; Value: 2.2K; Part Type: 通用厚膜电阻; Created by: YTL; ClassName: RK
R1608 = RESISTOR: 通用厚膜电阻,2K2,+/-5%,R0201,1/20W.; Part Reference: R1608; Manufacturer PN: RC0201JR-072K2L; Manufacturer: YAGEO; Wattage: 1/20W; Priority: A; RK PN: 901000532; PCB Footprint: R0201; Value: 2.2K; Created by: YTL; Part Type: 通用厚膜电阻; ClassName: RK
U1000 = SOC_RK3562: ROCKCHIP SOC; Part Reference: U1000; Manufacturer: Rockchip (瑞芯微); SPLIT_INST: TRUE; SWAP_INFO: (S1+S2+S3+S4+S5+S6+S7+S8+S9+S10+S11+S12+S13+S14+S15+S16); Priority: A; RK PN: 906000425; PCB Footprint: BGA478_13R90X13R90X0R95; Value: RK3562; Created by: JJJ; Manufacturer PN: RK3562; Part Type: SOC; ClassName: RK

## Sheet RK3562-VCCIO6.SchDoc
size 420 x 297 mm; SheetNumber: 11; SheetTotal: 32
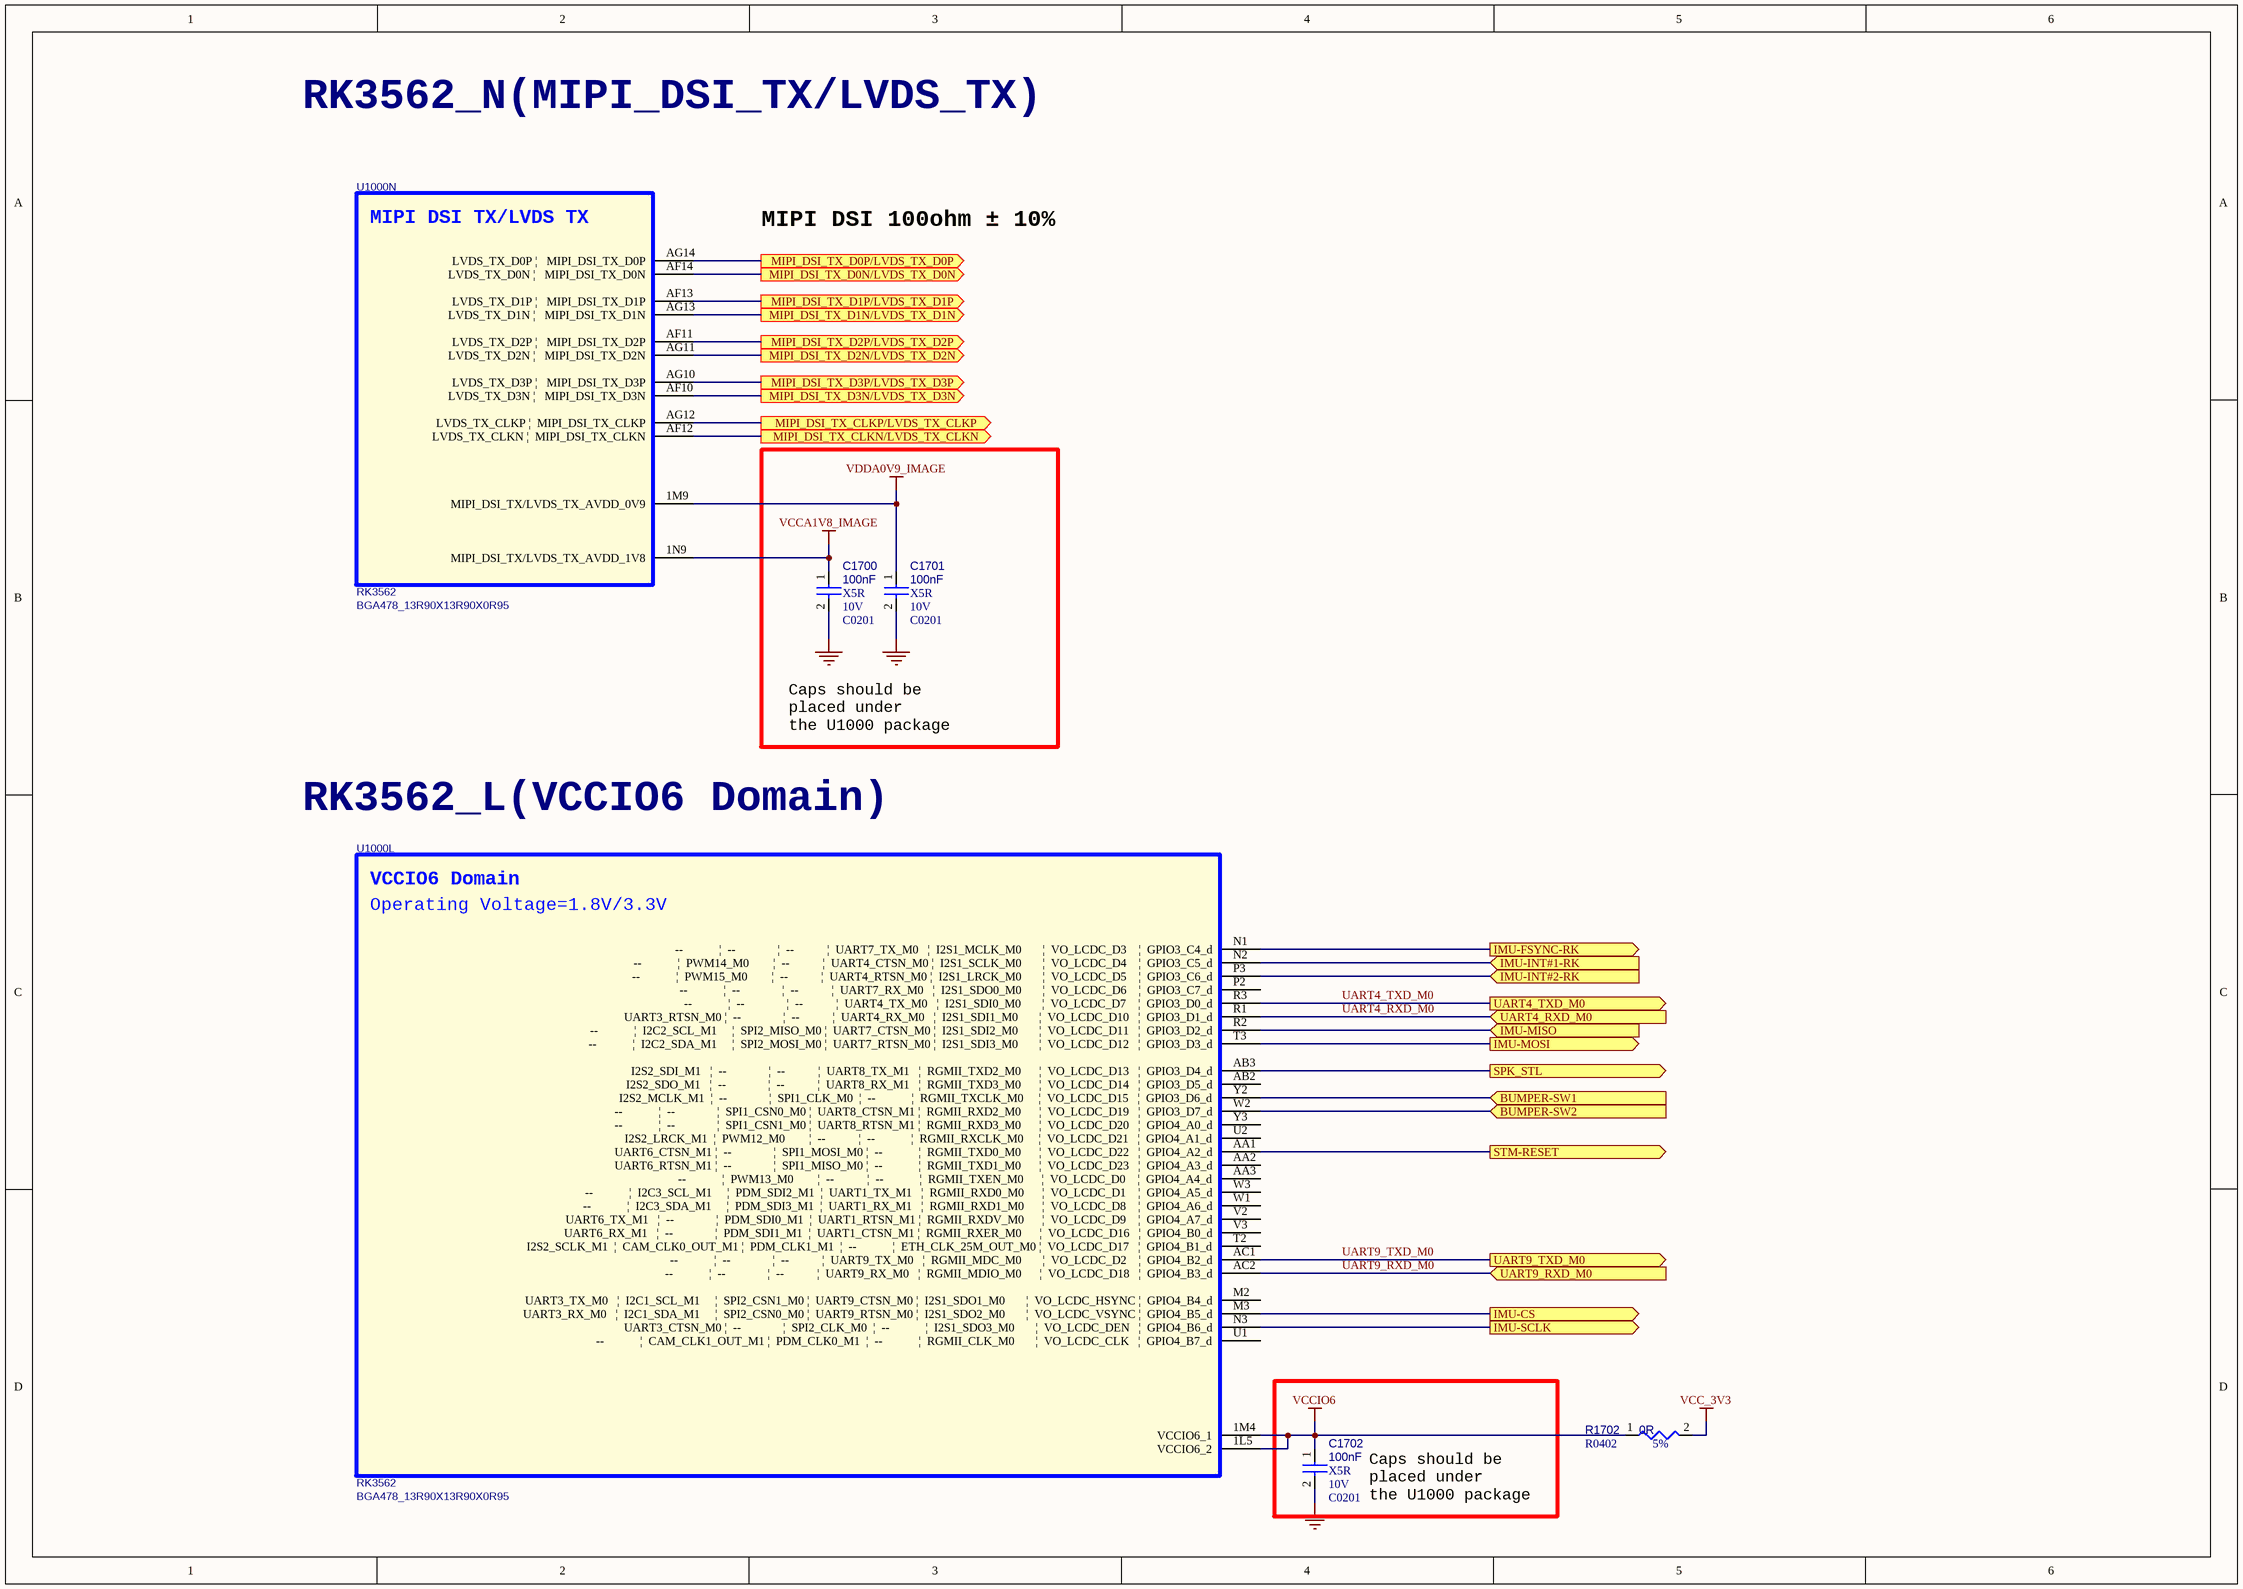
[diagram p12: RK3562-VCCIO6.SchDoc]

### Parts
C1700  100nF  Dielectric: X5R  Voltage: 10V  [C0201]
C1701  100nF  Dielectric: X5R  Voltage: 10V  [C0201]
C1702  100nF  Dielectric: X5R  Voltage: 10V  [C0201]
R1702  0R  Tolerance: 5%  [R0402]
U1000  RK3562  [BGA478_13R90X13R90X0R95]  (parts L,N of 16)

### Ports
BUMPER-SW1 (in, see CONTROLLER-RK3562[4D], CONTROLLER-RK3562[3D]), BUMPER-SW2 (in, see CONTROLLER-RK3562[4D], CONTROLLER-RK3562[3D]), IMU-CS (out, see CONTROLLER-RK3562[4D], CONTROLLER-RK3562[3D]), IMU-FSYNC-RK (out, see CONTROLLER-RK3562[4D], CONTROLLER-RK3562[3D]), IMU-INT#1-RK (in, see CONTROLLER-RK3562[4D], CONTROLLER-RK3562[3D]), IMU-INT#2-RK (in, see CONTROLLER-RK3562[4D], CONTROLLER-RK3562[3D]), IMU-MISO (in, see CONTROLLER-RK3562[4D], CONTROLLER-RK3562[3D]), IMU-MOSI (out, see CONTROLLER-RK3562[4D], CONTROLLER-RK3562[3D]), IMU-SCLK (out, see CONTROLLER-RK3562[4D], CONTROLLER-RK3562[3D]), MIPI_DSI_TX_CLKN/LVDS_TX_CLKN (out, see CONTROLLER-RK3562[4C]), MIPI_DSI_TX_CLKP/LVDS_TX_CLKP (out, see CONTROLLER-RK3562[4C]), MIPI_DSI_TX_D0N/LVDS_TX_D0N (out, see CONTROLLER-RK3562[4C]), MIPI_DSI_TX_D0P/LVDS_TX_D0P (out, see CONTROLLER-RK3562[4C]), MIPI_DSI_TX_D1N/LVDS_TX_D1N (out, see CONTROLLER-RK3562[4C]), MIPI_DSI_TX_D1P/LVDS_TX_D1P (out, see CONTROLLER-RK3562[4C]), MIPI_DSI_TX_D2N/LVDS_TX_D2N (out, see CONTROLLER-RK3562[4C]), MIPI_DSI_TX_D2P/LVDS_TX_D2P (out, see CONTROLLER-RK3562[4C]), MIPI_DSI_TX_D3N/LVDS_TX_D3N (out, see CONTROLLER-RK3562[4C]), MIPI_DSI_TX_D3P/LVDS_TX_D3P (out, see CONTROLLER-RK3562[4C]), SPK_STL (out, see CONTROLLER-RK3562[4C]), STM-RESET (out, see CONTROLLER-RK3562[4D], CONTROLLER-RK3562[3D], STM32G070RBT6[1A]), UART4_RXD_M0 (in, see CONTROLLER-RK3562[4C]), UART4_TXD_M0 (out, see CONTROLLER-RK3562[4C]), UART9_RXD_M0 (in, see CONTROLLER-RK3562[4D]), UART9_TXD_M0 (out, see CONTROLLER-RK3562[4D])

### Nets
GND: C1700.2 C1701.2 C1702.2
VCC_3V3: R1702.2
VCCA1V8_IMAGE: C1700.1 U1000.1N9(MIPI_DSI_TX/LVDS_TX_AVDD_1V8)
VCCIO6: C1702.1 R1702.1 U1000.1L5(VCCIO6_2) U1000.1M4(VCCIO6_1)
VDDA0V9_IMAGE: C1701.1 U1000.1M9(MIPI_DSI_TX/LVDS_TX_AVDD_0V9)
IMU-CS: U1000.M3(UART3_RX_M0___|__I2C1_SDA_M1_____|__SPI2_CSN0_M0_|__UART9_RTSN_M0_|__I2S1_SDO2_M0_______|__VO_LCDC_VSYNC_|__GPIO4_B5_d) ; port IMU-CS
IMU-FSYNC: U1000.N1(--____________|__--______________|__--___________|__UART7_TX_M0___|__I2S1_MCLK_M0_______|__VO_LCDC_D3____|__GPIO3_C4_d) ; port IMU-FSYNC-RK
IMU-INT1: U1000.N2(--____________|__PWM14_M0________|__--___________|__UART4_CTSN_M0_|__I2S1_SCLK_M0_______|__VO_LCDC_D4____|__GPIO3_C5_d) ; port IMU-INT#1-RK
IMU-INT2: U1000.P3(--____________|__PWM15_M0________|__--___________|__UART4_RTSN_M0_|__I2S1_LRCK_M0_______|__VO_LCDC_D5____|__GPIO3_C6_d) ; port IMU-INT#2-RK
IMU-MISO: U1000.R2(--____________|__I2C2_SCL_M1_____|__SPI2_MISO_M0_|__UART7_CTSN_M0_|__I2S1_SDI2_M0_______|__VO_LCDC_D11___|__GPIO3_D2_d) ; port IMU-MISO
IMU-MOSI: U1000.T3(--____________|__I2C2_SDA_M1_____|__SPI2_MOSI_M0_|__UART7_RTSN_M0_|__I2S1_SDI3_M0_______|__VO_LCDC_D12___|__GPIO3_D3_d) ; port IMU-MOSI
IMU-SCLK: U1000.N3(UART3_CTSN_M0_|__--______________|__SPI2_CLK_M0__|__--____________|__I2S1_SDO3_M0_______|__VO_LCDC_DEN___|__GPIO4_B6_d) ; port IMU-SCLK
STM32-RST: U1000.AA1(UART6_CTSN_M1_|__--______________|__SPI1_MOSI_M0_|__--____________|__RGMII_TXD0_M0______|__VO_LCDC_D22___|__GPIO4_A2_d) ; port STM-RESET
UART4_RXD_M0: U1000.R1(UART3_RTSN_M0_|__--______________|__--___________|__UART4_RX_M0___|__I2S1_SDI1_M0_______|__VO_LCDC_D10___|__GPIO3_D1_d) ; port UART4_RXD_M0
UART4_TXD_M0: U1000.R3(--____________|__--______________|__--___________|__UART4_TX_M0___|__I2S1_SDI0_M0_______|__VO_LCDC_D7____|__GPIO3_D0_d) ; port UART4_TXD_M0  [project net LiDAR-TXD]
UART9_RXD_M0: U1000.AC2(--____________|__--______________|__--___________|__UART9_RX_M0___|__RGMII_MDIO_M0______|__VO_LCDC_D18___|__GPIO4_B3_d) ; port UART9_RXD_M0
UART9_TXD_M0: U1000.AC1(--____________|__--______________|__--___________|__UART9_TX_M0___|__RGMII_MDC_M0_______|__VO_LCDC_D2____|__GPIO4_B2_d) ; port UART9_TXD_M0
NetU1000_AB3: U1000.AB3(I2S2_SDI_M1___|__--______________|__--___________|__UART8_TX_M1___|__RGMII_TXD2_M0______|__VO_LCDC_D13___|__GPIO3_D4_d) ; port SPK_STL
NetU1000_AF10: U1000.AF10(LVDS_TX_D3N_|___MIPI_DSI_TX_D3N) ; port MIPI_DSI_TX_D3N/LVDS_TX_D3N
NetU1000_AF11: U1000.AF11(LVDS_TX_D2P_|___MIPI_DSI_TX_D2P) ; port MIPI_DSI_TX_D2P/LVDS_TX_D2P
NetU1000_AF12: U1000.AF12(LVDS_TX_CLKN_|__MIPI_DSI_TX_CLKN) ; port MIPI_DSI_TX_CLKN/LVDS_TX_CLKN
NetU1000_AF13: U1000.AF13(LVDS_TX_D1P_|___MIPI_DSI_TX_D1P) ; port MIPI_DSI_TX_D1P/LVDS_TX_D1P
NetU1000_AF14: U1000.AF14(LVDS_TX_D0N_|___MIPI_DSI_TX_D0N) ; port MIPI_DSI_TX_D0N/LVDS_TX_D0N
NetU1000_AG10: U1000.AG10(LVDS_TX_D3P_|___MIPI_DSI_TX_D3P) ; port MIPI_DSI_TX_D3P/LVDS_TX_D3P
NetU1000_AG11: U1000.AG11(LVDS_TX_D2N_|___MIPI_DSI_TX_D2N) ; port MIPI_DSI_TX_D2N/LVDS_TX_D2N
NetU1000_AG12: U1000.AG12(LVDS_TX_CLKP_|__MIPI_DSI_TX_CLKP) ; port MIPI_DSI_TX_CLKP/LVDS_TX_CLKP
NetU1000_AG13: U1000.AG13(LVDS_TX_D1N_|___MIPI_DSI_TX_D1N) ; port MIPI_DSI_TX_D1N/LVDS_TX_D1N
NetU1000_AG14: U1000.AG14(LVDS_TX_D0P_|___MIPI_DSI_TX_D0P) ; port MIPI_DSI_TX_D0P/LVDS_TX_D0P
NetU1000_W2: U1000.W2(--____________|__--______________|__SPI1_CSN0_M0_|__UART8_CTSN_M1_|__RGMII_RXD2_M0______|__VO_LCDC_D19___|__GPIO3_D7_d) ; port BUMPER-SW2
NetU1000_Y2: U1000.Y2(I2S2_MCLK_M1__|__--______________|__SPI1_CLK_M0__|__--____________|__RGMII_TXCLK_M0_____|__VO_LCDC_D15___|__GPIO3_D6_d) ; port BUMPER-SW1

Not connected (* = marked no-connect by the designer): U1000 AA2(UART6_RTSN_M1_|__--______________|__SPI1_MISO_M0_|__--____________|__RGMII_TXD1_M0______|__VO_LCDC_D23___|__GPIO4_A3_d) AA3(--____________|__PWM13_M0________|__--___________|__--____________|__RGMII_TXEN_M0______|__VO_LCDC_D0____|__GPIO4_A4_d) AB2(I2S2_SDO_M1___|__--______________|__--___________|__UART8_RX_M1___|__RGMII_TXD3_M0______|__VO_LCDC_D14___|__GPIO3_D5_d) M2(UART3_TX_M0___|__I2C1_SCL_M1_____|__SPI2_CSN1_M0_|__UART9_CTSN_M0_|__I2S1_SDO1_M0_______|__VO_LCDC_HSYNC_|__GPIO4_B4_d) P2(--____________|__--______________|__--___________|__UART7_RX_M0___|__I2S1_SDO0_M0_______|__VO_LCDC_D6____|__GPIO3_C7_d) T2(I2S2_SCLK_M1__|__CAM_CLK0_OUT_M1_|__PDM_CLK1_M1__|__--____________|__ETH_CLK_25M_OUT_M0_|__VO_LCDC_D17___|__GPIO4_B1_d) U1(--____________|__CAM_CLK1_OUT_M1_|__PDM_CLK0_M1__|__--____________|__RGMII_CLK_M0_______|__VO_LCDC_CLK___|__GPIO4_B7_d) U2(I2S2_LRCK_M1__|__PWM12_M0________|__--___________|__--____________|__RGMII_RXCLK_M0_____|__VO_LCDC_D21___|__GPIO4_A1_d) V2(UART6_TX_M1___|__--______________|__PDM_SDI0_M1__|__UART1_RTSN_M1_|__RGMII_RXDV_M0______|__VO_LCDC_D9____|__GPIO4_A7_d) V3(UART6_RX_M1___|__--______________|__PDM_SDI1_M1__|__UART1_CTSN_M1_|__RGMII_RXER_M0______|__VO_LCDC_D16___|__GPIO4_B0_d) W1(--____________|__I2C3_SDA_M1_____|__PDM_SDI3_M1__|__UART1_RX_M1___|__RGMII_RXD1_M0______|__VO_LCDC_D8____|__GPIO4_A6_d) W3(--____________|__I2C3_SCL_M1_____|__PDM_SDI2_M1__|__UART1_TX_M1___|__RGMII_RXD0_M0______|__VO_LCDC_D1____|__GPIO4_A5_d) Y3(--____________|__--______________|__SPI1_CSN1_M0_|__UART8_RTSN_M1_|__RGMII_RXD3_M0______|__VO_LCDC_D20___|__GPIO4_A0_d)

### Notes on the sheet
- RK3562_N(MIPI_DSI_TX/LVDS_TX)
- MIPI DSI 100ohm ± 10%
- Caps should be
  placed under
  the U1000 package
- RK3562_L(VCCIO6 Domain)
- (in symbol SOC_RK3562, part L) VCCIO6 Domain; Operating Voltage=1.8V/3.3V
- (in symbol SOC_RK3562, part N) MIPI DSI TX/LVDS TX

### Library data of the parts
C1700 = CAP NP: cap,100.00nF,+/-10%,10V,X5R,C0201; Part Reference: C1700; Manufacturer PN: C0603X5R1A104K030BC; Manufacturer: TDK; Tolerance: 10%; Priority: A; PCB Footprint: C0201; Value: 100nF; Created by: JJJ; Part Type: C0201; RK PN: C0603X5R1A104K030BC; ClassName: RK
C1701 = CAP NP: cap,100.00nF,+/-10%,10V,X5R,C0201; Part Reference: C1701; Manufacturer: TDK; RK PN: C0603X5R1A104K030BC; Priority: A; Tolerance: 10%; PCB Footprint: C0201; Value: 100nF; Part Type: C0201; Manufacturer PN: C0603X5R1A104K030BC; Created by: JJJ; ClassName: RK
C1702 = CAP NP: cap,100.00nF,+/-10%,10V,X5R,C0201; Part Reference: C1702; Manufacturer PN: C0603X5R1A104K030BC; Manufacturer: TDK; Tolerance: 10%; Priority: A; PCB Footprint: C0201; Value: 100nF; Created by: JJJ; Part Type: C0201; RK PN: C0603X5R1A104K030BC; ClassName: RK
R1702 = RESISTOR: 通用厚膜电阻,0R,+/-5%,R0402,1/16W.; Part Reference: R1702; Manufacturer: YAGEO; Manufacturer PN: RC0402JR-070RL; RK PN: 901001446; Priority: A; Wattage: 1/16W; PCB Footprint: R0402; Value: 0R; Part Type: 通用厚膜电阻; Created by: YTL; ClassName: RK
U1000 = SOC_RK3562: as U1000 on sheet RK3562-VCCIO5; PCB Footprint: BGA478_13R90X13R90X0R95; Value: RK3562; Created by: JJJ; Manufacturer PN: RK3562; Part Type: SOC; ClassName: RK

## Sheet RK3562-USB-PCIe-PHY.SchDoc
size 381 x 237 mm; SheetNumber: 12; SheetTotal: 32
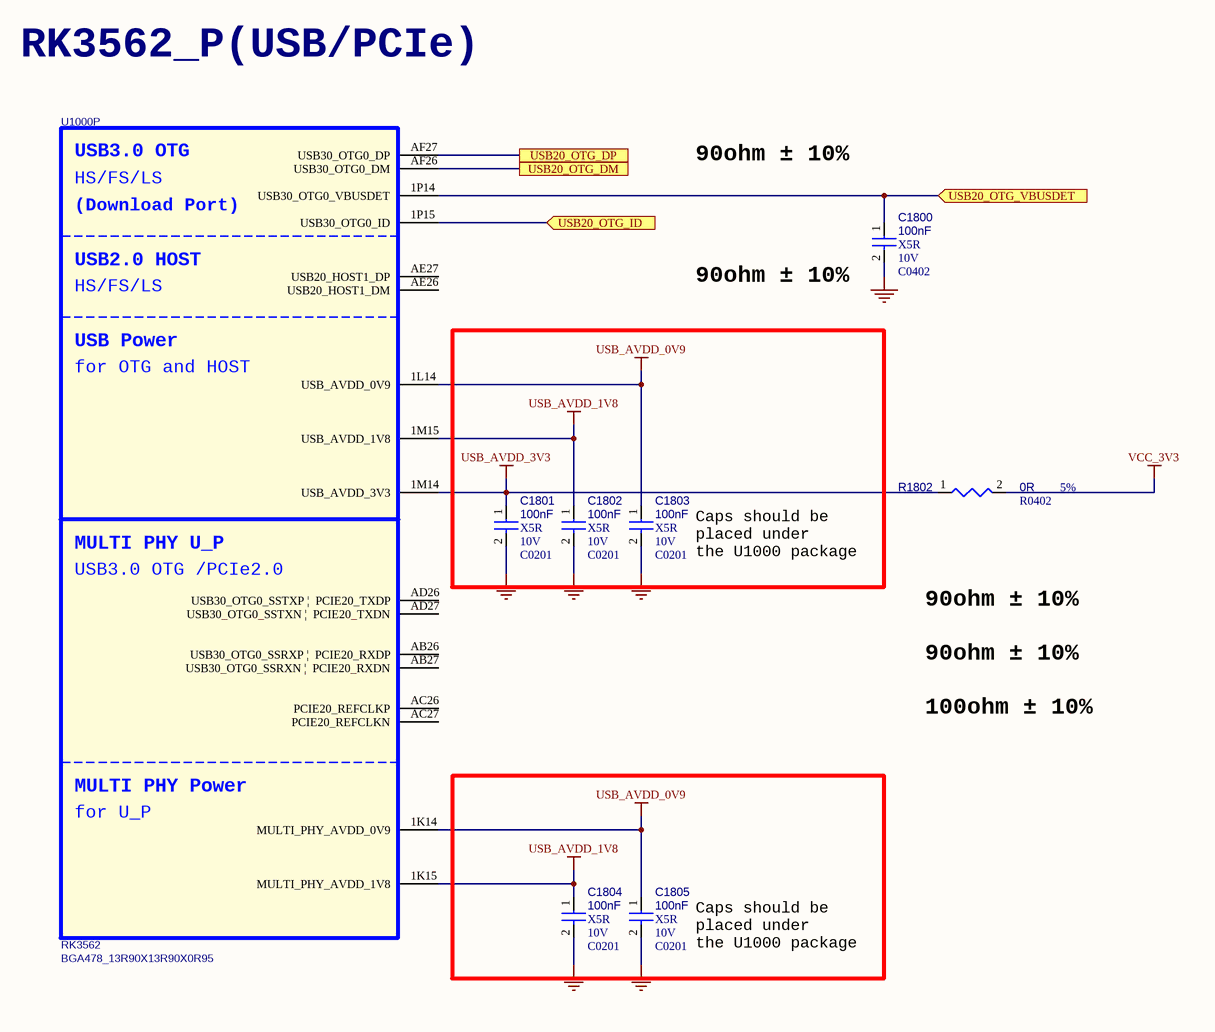
[diagram p13: RK3562-USB-PCIe-PHY.SchDoc]

### Parts
C1800  100nF  Dielectric: X5R  Voltage: 10V  [C0402]
C1801  100nF  Dielectric: X5R  Voltage: 10V  [C0201]
C1802  100nF  Dielectric: X5R  Voltage: 10V  [C0201]
C1803  100nF  Dielectric: X5R  Voltage: 10V  [C0201]
C1804  100nF  Dielectric: X5R  Voltage: 10V  [C0201]
C1805  100nF  Dielectric: X5R  Voltage: 10V  [C0201]
R1802  0R  Tolerance: 5%  [R0402]
U1000  RK3562  [BGA478_13R90X13R90X0R95]  (part P of 16)

### Ports
USB20_OTG_DM (see CONTROLLER-RK3562[6D]), USB20_OTG_DP (see CONTROLLER-RK3562[6D]), USB20_OTG_ID (in, see CONTROLLER-RK3562[6D]), USB20_OTG_VBUSDET (in, see CONTROLLER-RK3562[6D])

### Nets
GND: C1800.2 C1801.2 C1802.2 C1803.2 C1804.2 C1805.2
USB_AVDD_0V9: C1803.1 C1805.1 U1000.1K14(MULTI_PHY_AVDD_0V9) U1000.1L14(USB_AVDD_0V9)
USB_AVDD_1V8: C1802.1 C1804.1 U1000.1K15(MULTI_PHY_AVDD_1V8) U1000.1M15(USB_AVDD_1V8)
USB_AVDD_3V3: C1801.1 R1802.1 U1000.1M14(USB_AVDD_3V3)
VCC_3V3: R1802.2
NetC1800_1: C1800.1 U1000.1P14(USB30_OTG0_VBUSDET) ; port USB20_OTG_VBUSDET
NetJ2_3: U1000.AF27(USB30_OTG0_DP) ; port USB20_OTG_DP
NetJ2_4: U1000.AF26(USB30_OTG0_DM) ; port USB20_OTG_DM
NetU1000_1P15: U1000.1P15(USB30_OTG0_ID) ; port USB20_OTG_ID

Not connected (* = marked no-connect by the designer): U1000 AB26(USB30_OTG0_SSRXP_|__PCIE20_RXDP) AB27(USB30_OTG0_SSRXN_|__PCIE20_RXDN) AC26(PCIE20_REFCLKP) AC27(PCIE20_REFCLKN) AD26(USB30_OTG0_SSTXP_|__PCIE20_TXDP) AD27(USB30_OTG0_SSTXN_|__PCIE20_TXDN) AE26(USB20_HOST1_DM) AE27(USB20_HOST1_DP)

### Notes on the sheet
- RK3562_P(USB/PCIe)
- 90ohm ± 10%
- Caps should be
  placed under
  the U1000 package
- 100ohm ± 10%
- (in symbol SOC_RK3562, part P) USB3.0 OTG; HS/FS/LS; (Download Port); USB2.0 HOST; USB Power; for OTG and HOST; MULTI PHY U_P; USB3.0 OTG /PCIe2.0; MULTI PHY Power; for U_P

### Library data of the parts
C1800 = CAP NP: cap,100.00nF,+/-10%,10V,X5R,C0402; Part Reference: C1800; Manufacturer PN: C1005X5R1A104K050BA; Manufacturer: TDK; Tolerance: 10%; Priority: A; PCB Footprint: C0402; Value: 100nF; Created by: JJJ; Part Type: C0402; RK PN: C1005X5R1A104K050BA; ClassName: RK
C1801 = CAP NP: cap,100.00nF,+/-10%,10V,X5R,C0201; Part Reference: C1801; Manufacturer: TDK; RK PN: C0603X5R1A104K030BC; Priority: A; Tolerance: 10%; PCB Footprint: C0201; Value: 100nF; Part Type: C0201; Manufacturer PN: C0603X5R1A104K030BC; Created by: JJJ; ClassName: RK
C1802 = CAP NP: cap,100.00nF,+/-10%,10V,X5R,C0201; Part Reference: C1802; Manufacturer: TDK; RK PN: C0603X5R1A104K030BC; Priority: A; Tolerance: 10%; PCB Footprint: C0201; Value: 100nF; Part Type: C0201; Manufacturer PN: C0603X5R1A104K030BC; Created by: JJJ; ClassName: RK
C1803 = CAP NP: cap,100.00nF,+/-10%,10V,X5R,C0201; Part Reference: C1803; Manufacturer: TDK; RK PN: C0603X5R1A104K030BC; Priority: A; Tolerance: 10%; PCB Footprint: C0201; Value: 100nF; Part Type: C0201; Manufacturer PN: C0603X5R1A104K030BC; Created by: JJJ; ClassName: RK
C1804 = CAP NP: cap,100.00nF,+/-10%,10V,X5R,C0201; Part Reference: C1804; Manufacturer: TDK; RK PN: C0603X5R1A104K030BC; Priority: A; Tolerance: 10%; PCB Footprint: C0201; Value: 100nF; Part Type: C0201; Manufacturer PN: C0603X5R1A104K030BC; Created by: JJJ; ClassName: RK
C1805 = CAP NP: cap,100.00nF,+/-10%,10V,X5R,C0201; Part Reference: C1805; Manufacturer PN: C0603X5R1A104K030BC; Manufacturer: TDK; Tolerance: 10%; Priority: A; PCB Footprint: C0201; Value: 100nF; Created by: JJJ; Part Type: C0201; RK PN: C0603X5R1A104K030BC; ClassName: RK
R1802 = RESISTOR: 通用厚膜电阻,0R,+/-5%,R0402,1/16W.; Part Reference: R1802; Manufacturer PN: RC0402JR-070RL; Manufacturer: YAGEO; Wattage: 1/16W; Priority: A; RK PN: 901001446; PCB Footprint: R0402; Value: 0R; Created by: YTL; Part Type: 通用厚膜电阻; ClassName: RK
U1000 = SOC_RK3562: as U1000 on sheet RK3562-VCCIO5; PCB Footprint: BGA478_13R90X13R90X0R95; Value: RK3562; Created by: JJJ; Manufacturer PN: RK3562; Part Type: SOC; ClassName: RK